# Altium project REG.PrjPcb (part 1 of 2)
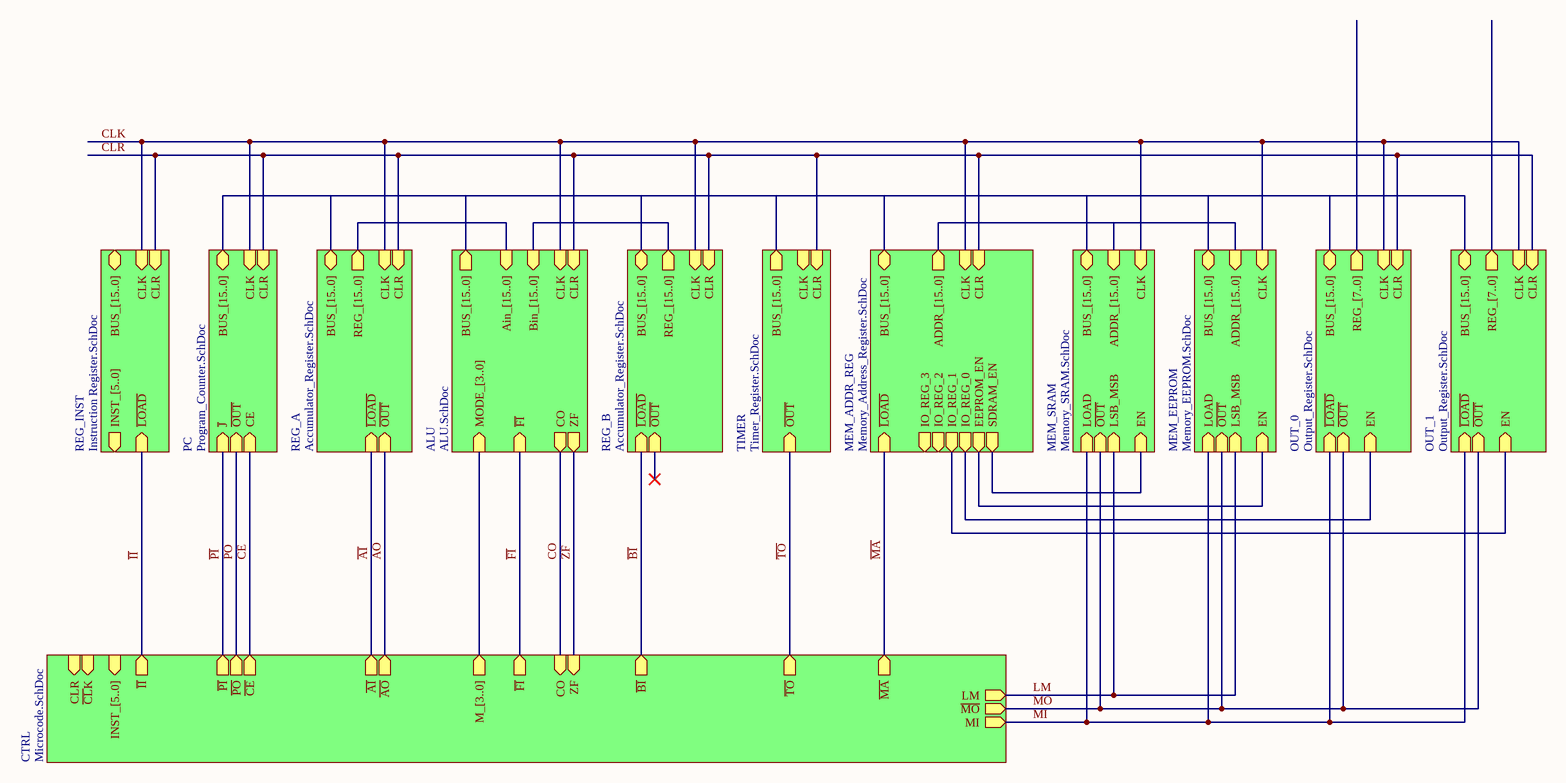
[diagram p0: TOP.SchDoc]
17 sheets, 108 parts. Net scope: hierarchical (ports join the sheet entries above them; power ports are global).
Board file: PCB1.PcbDoc
Sheets:
  TOP.SchDoc
    REG_A = Accumulator_Register.SchDoc
    REG_B = Accumulator_Register.SchDoc
    PC = Program_Counter.SchDoc
    MEM_ADDR_REG = Memory_Address_Register.SchDoc
    MEM_SRAM = Memory_SRAM.SchDoc
    MEM_EEPROM = Memory_EEPROM.SchDoc
    ALU = ALU.SchDoc
      ALU_ADDER = ALU_Adder.SchDoc
      ALU_AND = ALU_AND.SchDoc
      ALU_OR = ALU_OR.SchDoc
      ALU_XOR = ALU_XOR.SchDoc
      ALU_SHIFTER = ALU_Shifter.SchDoc
      ALU_ZF = ALU_ZF.SchDoc
    OUT_0 = Output_Register.SchDoc
    REG_INST = Instruction Register.SchDoc
    CTRL = Microcode.SchDoc
    TIMER = Timer_Register.SchDoc
    OUT_1 = Output_Register.SchDoc

## Sheet TOP.SchDoc
size B; Author: E. Sims; Organization: Let's Build Rockets Inc.; SheetNumber: 1; SheetTotal: 16

### Sub-sheets
ALU = ALU.SchDoc: MODE_[3..0] (in), BUS_[15..0] (out), Ain_[15..0] (in), Bin_[15..0] (in), CO (out), CLK (in), ~{FI} (in), ZF (out), CLR (in)
CTRL = Microcode.SchDoc: ~{AO} (out), ~{CE} (out), MI (out), ~{MA} (out), ~{FI} (out), ~{PI} (out), ~{AI} (out), ~{II} (out), CLR (in), ~{PO} (out), LM (out), ~{MO} (out), ~{TO} (out), INST_[5..0] (in), ~{CL}K (in), ~{BI} (out), M_[3..0] (out), ZF (in), CO (in)
MEM_ADDR_REG = Memory_Address_Register.SchDoc: CLK (in), CLR (in), ~{LOAD} (in), BUS_[15..0] (bidir), ADDR_[15..0] (out), EEPROM_EN (out), SDRAM_EN (out), IO_REG_2 (out), IO_REG_3 (out), IO_REG_1 (out), IO_REG_0 (out)
MEM_EEPROM = Memory_EEPROM.SchDoc: CLK (in), BUS_[15..0] (bidir), ADDR_[15..0] (in), LOAD (in), LSB_MSB (in), ~{OUT} (in), EN (in)
MEM_SRAM = Memory_SRAM.SchDoc: CLK (in), BUS_[15..0] (bidir), ADDR_[15..0] (in), LOAD (in), LSB_MSB (in), ~{OUT} (in), EN (in)
OUT_0 = Output_Register.SchDoc: ~{LOAD} (in), CLR (in), BUS_[15..0] (bidir), ~{OUT} (in), CLK (in), REG_[7..0] (out), EN (in)
OUT_1 = Output_Register.SchDoc: ~{LOAD} (in), CLR (in), BUS_[15..0] (bidir), ~{OUT} (in), CLK (in), REG_[7..0] (out), EN (in)
PC = Program_Counter.SchDoc: CLK (in), ~{OUT} (in), CLR (in), BUS_[15..0] (bidir), CE (in), ~{J} (in)
REG_A = Accumulator_Register.SchDoc: CLK (in), ~{OUT} (in), CLR (in), ~{LOAD} (in), BUS_[15..0] (bidir), REG_[15..0] (out)
REG_B = Accumulator_Register.SchDoc: CLK (in), ~{OUT} (in), CLR (in), ~{LOAD} (in), BUS_[15..0] (bidir), REG_[15..0] (out)
REG_INST = Instruction Register.SchDoc: CLK (in), CLR (in), BUS_[15..0] (bidir), ~{LOAD} (in), INST_[5..0] (out)
TIMER = Timer_Register.SchDoc: CLK (in), ~{OUT} (in), CLR (in), BUS_[15..0] (out)

### Nets
~{AI}: sheet REG_A/~{LOAD}, sheet CTRL/~{AI}
~{AO}: sheet REG_A/~{OUT}, sheet CTRL/~{AO}
~{BI}: sheet REG_B/~{LOAD}, sheet CTRL/~{BI}
~{CE}: sheet PC/CE, sheet CTRL/~{CE}
CLK: sheet REG_A/CLK, sheet REG_B/CLK, sheet PC/CLK, sheet MEM_ADDR_REG/CLK, sheet MEM_SRAM/CLK, sheet MEM_EEPROM/CLK, sheet ALU/CLK, sheet OUT_0/CLK, sheet REG_INST/CLK, sheet OUT_1/CLK
CLR: sheet REG_A/CLR, sheet REG_B/CLR, sheet PC/CLR, sheet MEM_ADDR_REG/CLR, sheet ALU/CLR, sheet OUT_0/CLR, sheet REG_INST/CLR, sheet TIMER/CLR, sheet OUT_1/CLR
CO: sheet ALU/CO, sheet CTRL/CO
EN: sheet MEM_ADDR_REG/EEPROM_EN, sheet MEM_EEPROM/EN
EN: sheet MEM_ADDR_REG/SDRAM_EN, sheet MEM_SRAM/EN  [a separate net that carries the same name]
EN: sheet MEM_ADDR_REG/IO_REG_0, sheet OUT_0/EN  [a separate net that carries the same name]
EN: sheet MEM_ADDR_REG/IO_REG_1, sheet OUT_1/EN  [a separate net that carries the same name]
~{FI}: sheet ALU/~{FI}, sheet CTRL/~{FI}
~{II}: sheet REG_INST/~{LOAD}, sheet CTRL/~{II}
LM: sheet MEM_SRAM/LSB_MSB, sheet MEM_EEPROM/LSB_MSB, sheet CTRL/LM
~{MA}: sheet MEM_ADDR_REG/~{LOAD}, sheet CTRL/~{MA}  [project net ~{LOAD}]
~{MO}: sheet MEM_SRAM/~{OUT}, sheet MEM_EEPROM/~{OUT}, sheet OUT_0/~{OUT}, sheet CTRL/~{MO}, sheet OUT_1/~{OUT}
MI: sheet MEM_SRAM/LOAD, sheet MEM_EEPROM/LOAD, sheet OUT_0/~{LOAD}, sheet CTRL/MI, sheet OUT_1/~{LOAD}  [project net ~{LOAD}]
~{PI}: sheet PC/~{J}, sheet CTRL/~{PI}  [project net ~{J}]
~{PO}: sheet PC/~{OUT}, sheet CTRL/~{PO}  [project net ~{OUT}]
~{TO}: sheet CTRL/~{TO}, sheet TIMER/~{OUT}  [project net ~{OUT}]
ZF: sheet ALU/ZF, sheet CTRL/ZF

### Buses and harness runs
bus sheet ALU/Ain_[15..0] = sheet REG_A/REG_[15..0]
bus sheet ALU/Bin_[15..0] = sheet REG_B/REG_[15..0]
bus sheet ALU/BUS_[15..0] = sheet MEM_ADDR_REG/BUS_[15..0] = sheet MEM_EEPROM/BUS_[15..0] = sheet MEM_SRAM/BUS_[15..0] = sheet OUT_0/BUS_[15..0] = sheet OUT_1/BUS_[15..0] = sheet PC/BUS_[15..0] = sheet REG_A/BUS_[15..0] = sheet REG_B/BUS_[15..0] = sheet TIMER/BUS_[15..0]
bus sheet ALU/MODE_[3..0] = sheet CTRL/M_[3..0]
bus sheet MEM_ADDR_REG/ADDR_[15..0] = sheet MEM_EEPROM/ADDR_[15..0] = sheet MEM_SRAM/ADDR_[15..0]

### Notes on the sheet
- Let's Build Rocket's Inc. Modular Paylaod System Based on TMP-010 Rev
  For more information visit https://github.com/LetsBuildRockets/Modular-Payload-System
  This work is licensed under CC BY-NC 4.0. To view a copy of this license, visit https://creativecommons.org/licenses/by-nc/4.0
- Title
- Size:
- Date:
- Assembly Variant:
- B
- Number:
- Time:
- Revision:
- Sheet
- of
- Author:
- File:

## Sheet Accumulator_Register.SchDoc
size B; Author: E. Sims; Organization: Let's Build Rockets Inc.; SheetNumber: 2; SheetTotal: 16
Used 2 times, as channels REG_A, REG_B. Parts and nets are listed once, with the designators drawn on the sheet.
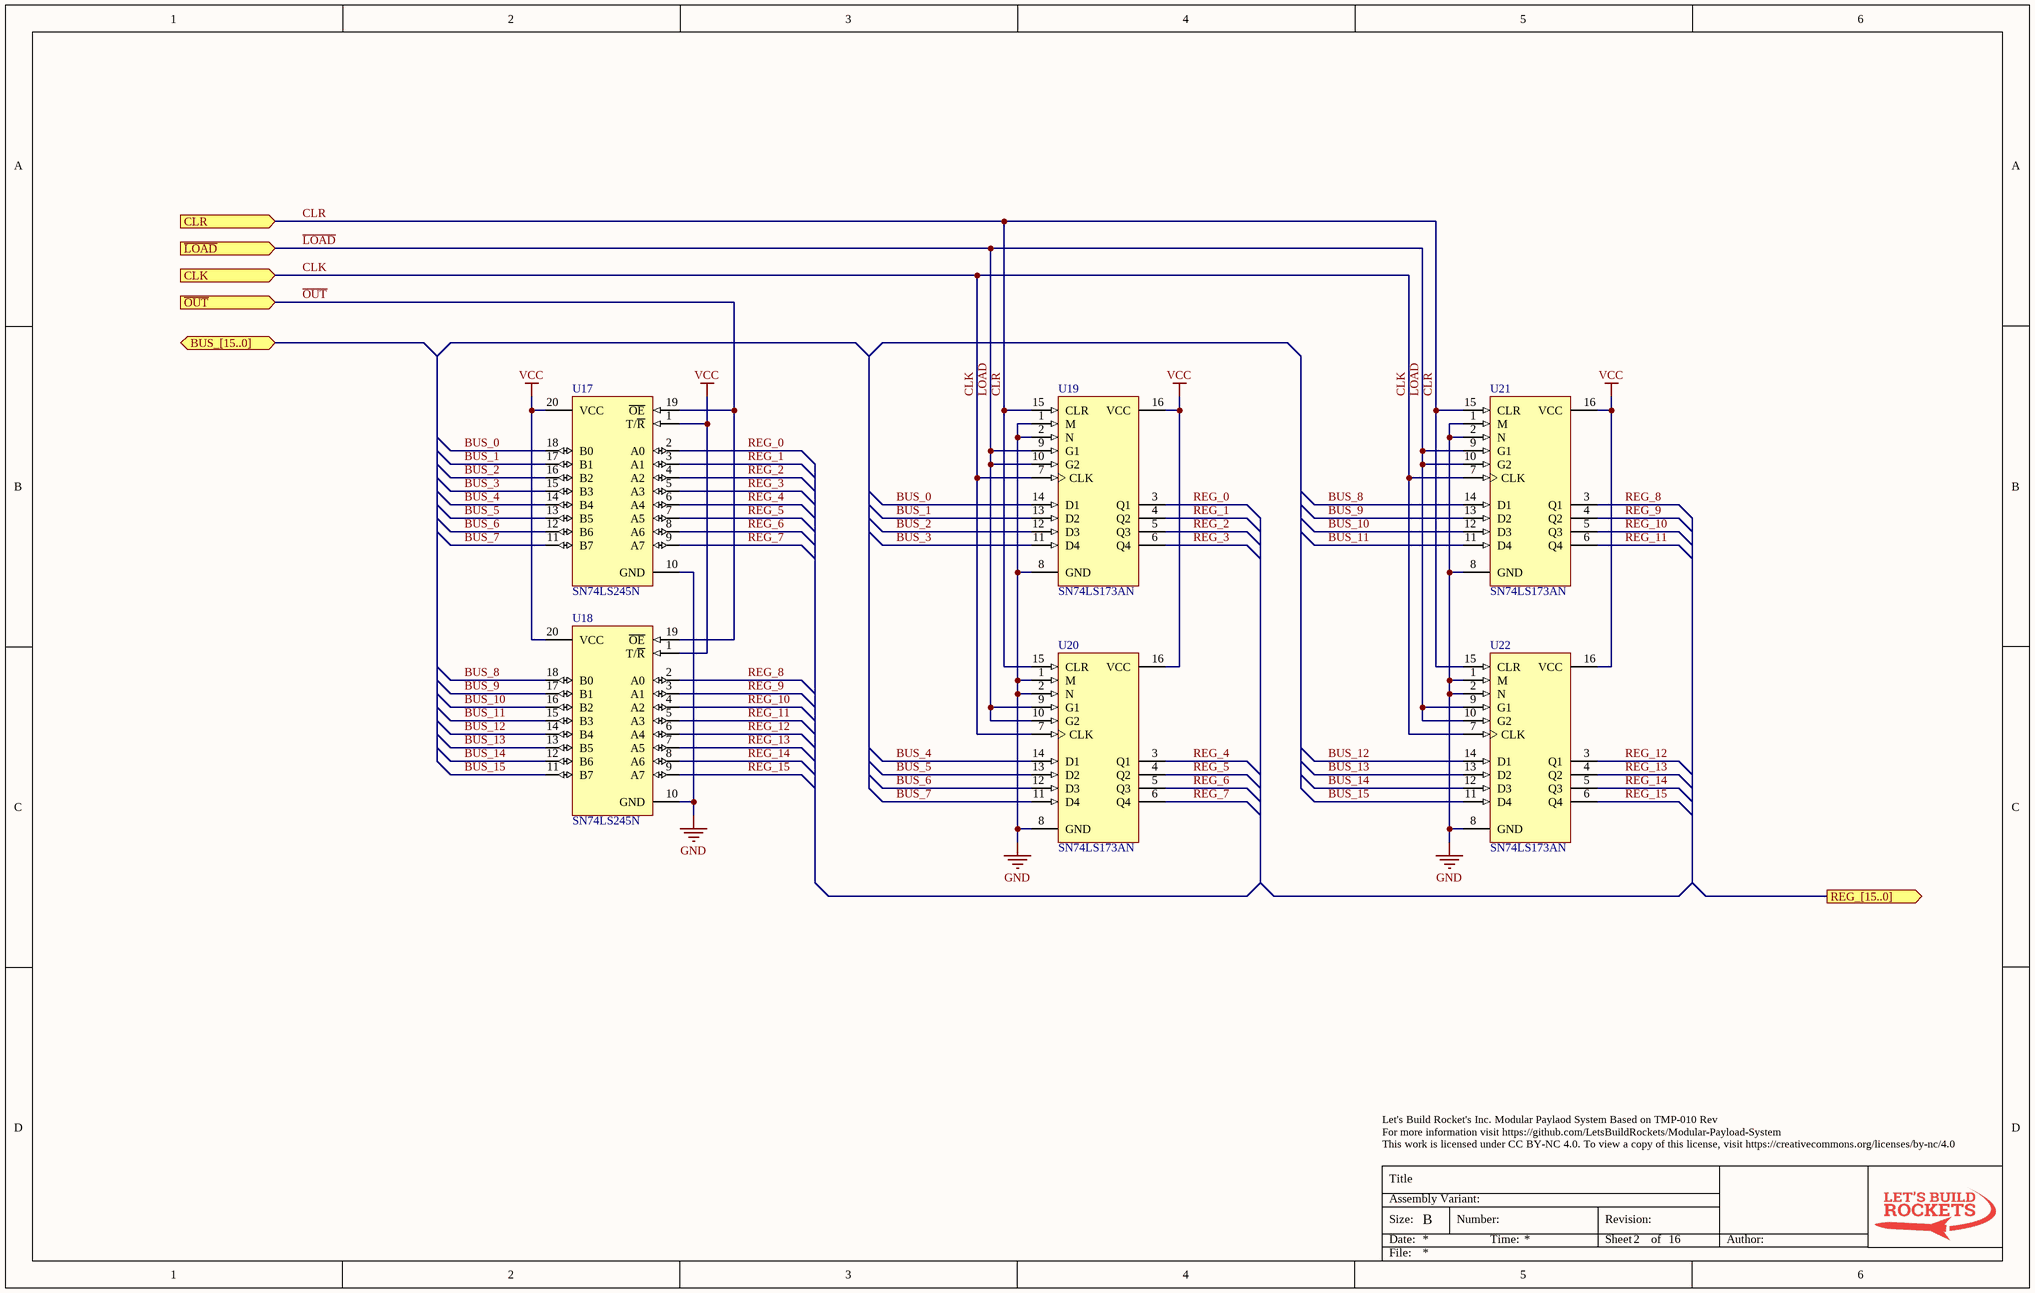
[diagram p1: Accumulator_Register.SchDoc]

### Parts
U17  SN74LS245N  [N020]
U18  SN74LS245N  [N020]
U19  SN74LS173AN  [N016D]
U20  SN74LS173AN  [N016D]
U21  SN74LS173AN  [N016D]
U22  SN74LS173AN  [N016D]

### Ports
BUS_[15..0] (bidir), CLK (in), CLR (in), REG_[15..0] (out), ~{LOAD} (in), ~{OUT} (in)

### Nets
GND: U17.10(GND) U18.10(GND) U19.1(M) U19.2(N) U19.8(GND) U20.1(M) U20.2(N) U20.8(GND) U21.1(M) U21.2(N) U21.8(GND) U22.1(M) U22.2(N) U22.8(GND)
VCC: U17.1(T/~{R}) U17.20(VCC) U18.1(T/~{R}) U18.20(VCC) U19.16(VCC) U20.16(VCC) U21.16(VCC) U22.16(VCC)
BUS_0: U17.18(B0) U19.14(D1)
BUS_1: U17.17(B1) U19.13(D2)
BUS_2: U17.16(B2) U19.12(D3)
BUS_3: U17.15(B3) U19.11(D4)
BUS_4: U17.14(B4) U20.14(D1)
BUS_5: U17.13(B5) U20.13(D2)
BUS_6: U17.12(B6) U20.12(D3)
BUS_7: U17.11(B7) U20.11(D4)
BUS_8: U18.18(B0) U21.14(D1)
BUS_9: U18.17(B1) U21.13(D2)
BUS_10: U18.16(B2) U21.12(D3)
BUS_11: U18.15(B3) U21.11(D4)
BUS_12: U18.14(B4) U22.14(D1)
BUS_13: U18.13(B5) U22.13(D2)
BUS_14: U18.12(B6) U22.12(D3)
BUS_15: U18.11(B7) U22.11(D4)
CLK: U19.7(CLK) U20.7(CLK) U21.7(CLK) U22.7(CLK) ; port CLK
CLR: U19.15(CLR) U20.15(CLR) U21.15(CLR) U22.15(CLR) ; port CLR
~{LOAD}: U19.9(G1) U19.10(G2) U20.9(G1) U20.10(G2) U21.9(G1) U21.10(G2) U22.9(G1) U22.10(G2) ; port ~{LOAD}
~{OUT}: U17.19(~{OE}) U18.19(~{OE}) ; port ~{OUT}
REG_0: U17.2(A0) U19.3(Q1)
REG_1: U17.3(A1) U19.4(Q2)
REG_2: U17.4(A2) U19.5(Q3)
REG_3: U17.5(A3) U19.6(Q4)
REG_4: U17.6(A4) U20.3(Q1)
REG_5: U17.7(A5) U20.4(Q2)
REG_6: U17.8(A6) U20.5(Q3)
REG_7: U17.9(A7) U20.6(Q4)
REG_8: U18.2(A0) U21.3(Q1)
REG_9: U18.3(A1) U21.4(Q2)
REG_10: U18.4(A2) U21.5(Q3)
REG_11: U18.5(A3) U21.6(Q4)
REG_12: U18.6(A4) U22.3(Q1)
REG_13: U18.7(A5) U22.4(Q2)
REG_14: U18.8(A6) U22.5(Q3)
REG_15: U18.9(A7) U22.6(Q4)

### Channels
REG_A: designators end in _REG_A; ports CLK=CLK CLR=CLR ~{LOAD}=~{AI} ~{OUT}=~{AO}
REG_B: designators end in _REG_B; ports CLK=CLK CLR=CLR ~{LOAD}=~{BI} ~{OUT}=~{OUT}_REG_B

### Notes on the sheet
- Let's Build Rocket's Inc. Modular Paylaod System Based on TMP-010 Rev
  For more information visit https://github.com/LetsBuildRockets/Modular-Payload-System
  This work is licensed under CC BY-NC 4.0. To view a copy of this license, visit https://creativecommons.org/licenses/by-nc/4.0
- Title
- Size:
- Date:
- Assembly Variant:
- B
- Number:
- Time:
- Revision:
- Sheet
- of
- Author:
- File:

### Library data of the parts
U17 U18 = SN74LS245N: Octal Bus Transceiver with 3-State Outputs; Published: 8-Jun-2000; LatestRevisionDate: 04-Mar-2005; LatestRevisionNote: Stylized 3D Model Added.; DatasheetVersion: Mar-1988; PackageVersion: Oct-1995; PackageReference: N020; Publisher: Altium Limited; PackageDescription: DIP; 20 Leads; Row Spacing 7.62 mm; Pitch 2.54 mm; ComponentLink1Description: Manufacturer Link; ComponentLink1URL: http://www.ti.com/; ComponentLink2Description: Datasheet; ComponentLink2URL: http://www-s.ti.com/sc/ds/sn74ls245.pdf
U19-U22 = SN74LS173AN: 4-Bit D-Type Register with 3-State Outputs; Published: 8-Jun-2000; LatestRevisionDate: 04-Mar-2005; LatestRevisionNote: Stylized 3D Model Added.; DatasheetVersion: Mar-1988; PackageVersion: Oct-1995; PackageReference: N016D; Publisher: Altium Limited; PackageDescription: DIP; 16 Leads; Row Spacing 7.62 mm; Pitch 2.54 mm; Code_JEDEC: MS-001-BB; ComponentLink1Description: Manufacturer Link; ComponentLink1URL: http://www.ti.com/; ComponentLink2Description: Datasheet; ComponentLink2URL: http://www-s.ti.com/sc/ds/sn74ls173a.pdf

## Sheet Program_Counter.SchDoc
size B; Author: E. Sims; Organization: Let's Build Rockets Inc.; SheetNumber: 3; SheetTotal: 16
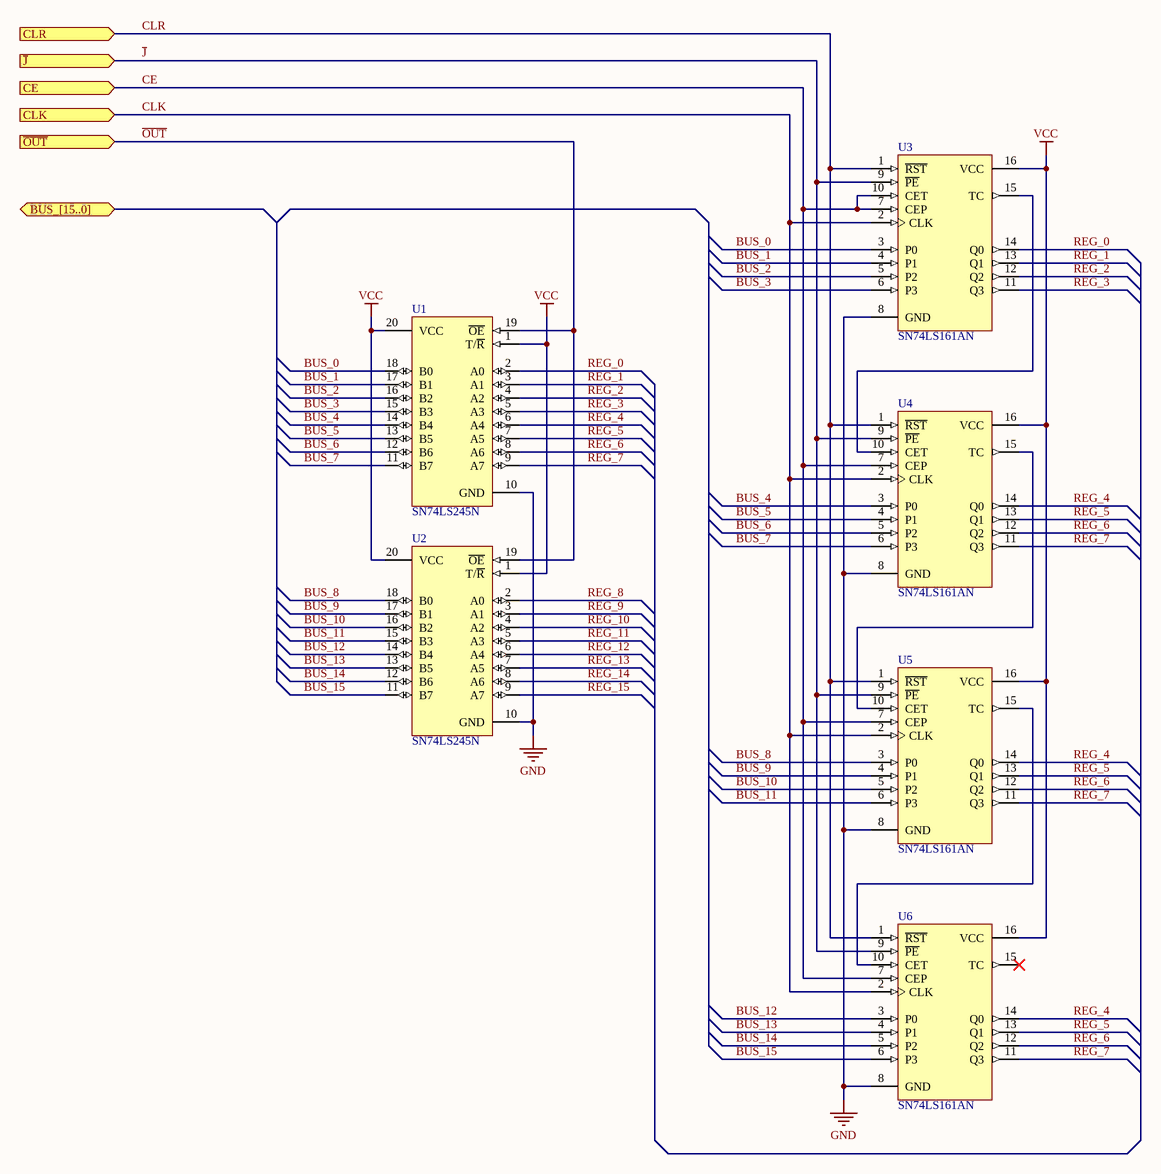
[diagram p2: Program_Counter.SchDoc]

### Parts
U1  SN74LS245N  [N020]
U2  SN74LS245N  [N020]
U3  SN74LS161AN  [N016]
U4  SN74LS161AN  [N016]
U5  SN74LS161AN  [N016]
U6  SN74LS161AN  [N016]

### Ports
BUS_[15..0] (bidir), CE (in), CLK (in), CLR (in), ~{J} (in), ~{OUT} (in)

### Nets
GND: U1.10(GND) U2.10(GND) U3.8(GND) U4.8(GND) U5.8(GND) U6.8(GND)
VCC: U1.1(T/~{R}) U1.20(VCC) U2.1(T/~{R}) U2.20(VCC) U3.16(VCC) U4.16(VCC) U5.16(VCC) U6.16(VCC)
BUS_0: U1.18(B0) U3.3(P0)
BUS_1: U1.17(B1) U3.4(P1)
BUS_2: U1.16(B2) U3.5(P2)
BUS_3: U1.15(B3) U3.6(P3)
BUS_4: U1.14(B4) U4.3(P0)
BUS_5: U1.13(B5) U4.4(P1)
BUS_6: U1.12(B6) U4.5(P2)
BUS_7: U1.11(B7) U4.6(P3)
BUS_8: U2.18(B0) U5.3(P0)
BUS_9: U2.17(B1) U5.4(P1)
BUS_10: U2.16(B2) U5.5(P2)
BUS_11: U2.15(B3) U5.6(P3)
BUS_12: U2.14(B4) U6.3(P0)
BUS_13: U2.13(B5) U6.4(P1)
BUS_14: U2.12(B6) U6.5(P2)
BUS_15: U2.11(B7) U6.6(P3)
CE: U3.7(CEP) U3.10(CET) U4.7(CEP) U5.7(CEP) U6.7(CEP) ; port CE  [project net ~{CE}]
CLK: U3.2(CLK) U4.2(CLK) U5.2(CLK) U6.2(CLK) ; port CLK
CLR: U3.1(~{RST}) U4.1(~{RST}) U5.1(~{RST}) U6.1(~{RST}) ; port CLR
~{J}: U3.9(~{PE}) U4.9(~{PE}) U5.9(~{PE}) U6.9(~{PE}) ; port ~{J}
~{OUT}: U1.19(~{OE}) U2.19(~{OE}) ; port ~{OUT}
REG_0: U1.2(A0) U3.14(Q0)
REG_1: U1.3(A1) U3.13(Q1)
REG_2: U1.4(A2) U3.12(Q2)
REG_3: U1.5(A3) U3.11(Q3)
REG_4: U1.6(A4) U4.14(Q0) U5.14(Q0) U6.14(Q0)
REG_5: U1.7(A5) U4.13(Q1) U5.13(Q1) U6.13(Q1)
REG_6: U1.8(A6) U4.12(Q2) U5.12(Q2) U6.12(Q2)
REG_7: U1.9(A7) U4.11(Q3) U5.11(Q3) U6.11(Q3)
REG_8: U2.2(A0)
REG_9: U2.3(A1)
REG_10: U2.4(A2)
REG_11: U2.5(A3)
REG_12: U2.6(A4)
REG_13: U2.7(A5)
REG_14: U2.8(A6)
REG_15: U2.9(A7)
NetU3_15: U3.15(TC) U4.10(CET)
NetU4_15: U4.15(TC) U5.10(CET)
NetU5_15: U5.15(TC) U6.10(CET)

Not connected (* = marked no-connect by the designer): U6 15(TC)*

### Notes on the sheet
- Let's Build Rocket's Inc. Modular Paylaod System Based on TMP-010 Rev
  For more information visit https://github.com/LetsBuildRockets/Modular-Payload-System
  This work is licensed under CC BY-NC 4.0. To view a copy of this license, visit https://creativecommons.org/licenses/by-nc/4.0
- Title
- Size:
- Date:
- Assembly Variant:
- B
- Number:
- Time:
- Revision:
- Sheet
- of
- Author:
- File:

### Library data of the parts
U1 U2 = SN74LS245N: as U17 on sheet Accumulator_Register; Published: 8-Jun-2000; LatestRevisionDate: 04-Mar-2005; LatestRevisionNote: Stylized 3D Model Added.; DatasheetVersion: Mar-1988; PackageVersion: Oct-1995; PackageReference: N020; Publisher: Altium Limited; PackageDescription: DIP; 20 Leads; Row Spacing 7.62 mm; Pitch 2.54 mm; ComponentLink1Description: Manufacturer Link; ComponentLink1URL: http://www.ti.com/; ComponentLink2Description: Datasheet; ComponentLink2URL: http://www-s.ti.com/sc/ds/sn74ls245.pdf
U3-U6 = SN74LS161AN: Synchronous 4-Bit Counter; Published: 8-Jun-2000; LatestRevisionDate: 04-Mar-2005; LatestRevisionNote: Stylized 3D Model Added.; DatasheetVersion: Mar-1988; PackageVersion: Oct-1995; PackageReference: N016; Publisher: Altium Limited; PackageDescription: DIP; 16 Leads; Row Spacing 7.62 mm; Pitch 2.54 mm; Code_JEDEC: MS-001-BB; ComponentLink1Description: Manufacturer Link; ComponentLink1URL: http://www.ti.com/; ComponentLink2Description: Datasheet; ComponentLink2URL: http://www-s.ti.com/sc/ds/sn74ls161a.pdf; ComponentLink3Description: URL Link1; ComponentLink3URL: http://focus.ti.com/docs/prod/folders/print/sn74ls161a.html

## Sheet Memory_Address_Register.SchDoc
size B; Author: E. Sims; Organization: Let's Build Rockets Inc.; SheetNumber: 4; SheetTotal: 16
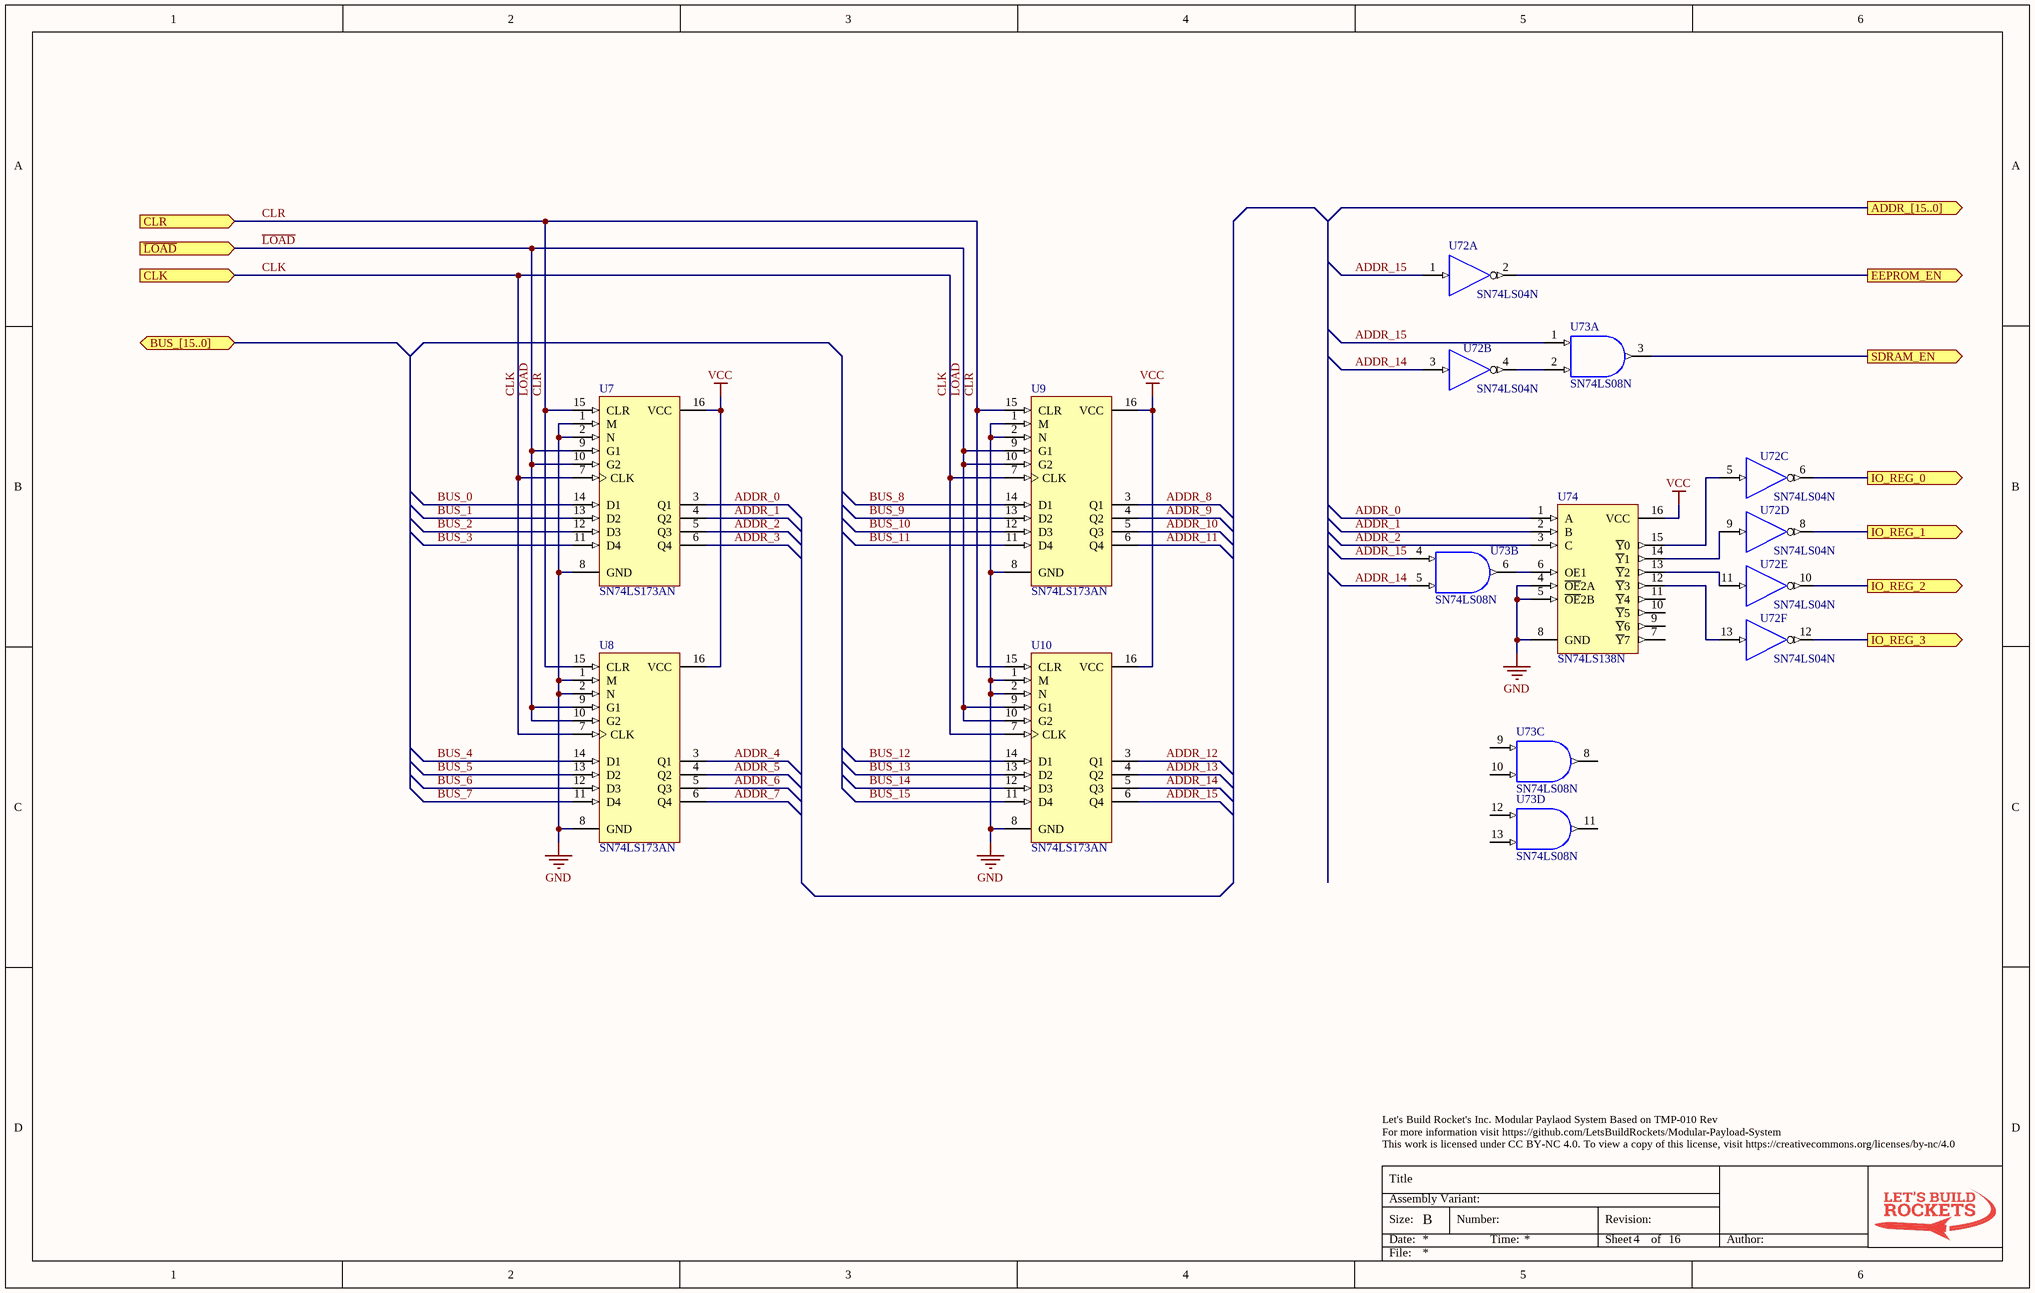
[diagram p3: Memory_Address_Register.SchDoc]

### Parts
U7  SN74LS173AN  [N016D]
U8  SN74LS173AN  [N016D]
U9  SN74LS173AN  [N016D]
U10  SN74LS173AN  [N016D]
U72  SN74LS04N  [N014]  (parts A,B,C,D,E,F of 6)
U73  SN74LS08N  [N014]  (parts A,B,C,D of 4)
U74  SN74LS138N  [N016]

### Ports
ADDR_[15..0] (out), BUS_[15..0] (bidir), CLK (in), CLR (in), EEPROM_EN (out), IO_REG_0 (out), IO_REG_1 (out), IO_REG_2 (out), IO_REG_3 (out), SDRAM_EN (out), ~{LOAD} (in)

### Nets
GND: U7.1(M) U7.2(N) U7.8(GND) U8.1(M) U8.2(N) U8.8(GND) U9.1(M) U9.2(N) U9.8(GND) U10.1(M) U10.2(N) U10.8(GND) U72.7(GND) U73.7(GND) U74.4(~{OE}2A) U74.5(~{OE}2B) U74.8(GND)
VCC: U7.16(VCC) U8.16(VCC) U9.16(VCC) U10.16(VCC) U72.14(VCC) U73.14(VCC) U74.16(VCC)
ADDR_0: U7.3(Q1) U74.1(A)
ADDR_1: U7.4(Q2) U74.2(B)
ADDR_2: U7.5(Q3) U74.3(C)
ADDR_3: U7.6(Q4)
ADDR_4: U8.3(Q1)
ADDR_5: U8.4(Q2)
ADDR_6: U8.5(Q3)
ADDR_7: U8.6(Q4)
ADDR_8: U9.3(Q1)
ADDR_9: U9.4(Q2)
ADDR_10: U9.5(Q3)
ADDR_11: U9.6(Q4)
ADDR_12: U10.3(Q1)
ADDR_13: U10.4(Q2)
ADDR_14: U10.5(Q3) U72.3(A) U73.5(B)
ADDR_15: U10.6(Q4) U72.1(A) U73.1(A) U73.4(A)
BUS_0: U7.14(D1)
BUS_1: U7.13(D2)
BUS_2: U7.12(D3)
BUS_3: U7.11(D4)
BUS_4: U8.14(D1)
BUS_5: U8.13(D2)
BUS_6: U8.12(D3)
BUS_7: U8.11(D4)
BUS_8: U9.14(D1)
BUS_9: U9.13(D2)
BUS_10: U9.12(D3)
BUS_11: U9.11(D4)
BUS_12: U10.14(D1)
BUS_13: U10.13(D2)
BUS_14: U10.12(D3)
BUS_15: U10.11(D4)
CLK: U7.7(CLK) U8.7(CLK) U9.7(CLK) U10.7(CLK) ; port CLK
CLR: U7.15(CLR) U8.15(CLR) U9.15(CLR) U10.15(CLR) ; port CLR
EN: U72.2(Y) ; port EEPROM_EN
EN: U73.3(Y) ; port SDRAM_EN  [a separate net that carries the same name]
EN: U72.6(Y) ; port IO_REG_0  [a separate net that carries the same name]
EN: U72.8(Y) ; port IO_REG_1  [a separate net that carries the same name]
~{LOAD}: U7.9(G1) U7.10(G2) U8.9(G1) U8.10(G2) U9.9(G1) U9.10(G2) U10.9(G1) U10.10(G2) ; port ~{LOAD}
NetU72_4: U72.4(Y) U73.2(B)
NetU72_5: U72.5(A) U74.15(~{Y}0)
NetU72_9: U72.9(A) U74.14(~{Y}1)
NetU72_10: U72.10(Y) ; port IO_REG_2
NetU72_11: U72.11(A) U74.13(~{Y}2)
NetU72_12: U72.12(Y) ; port IO_REG_3
NetU72_13: U72.13(A) U74.12(~{Y}3)
NetU73_6: U73.6(Y) U74.6(OE1)

Not connected (* = marked no-connect by the designer): U73 8(Y) 9(A) 10(B) 11(Y) 12(A) 13(B); U74 7(~{Y}7) 9(~{Y}6) 10(~{Y}5) 11(~{Y}4)

### Notes on the sheet
- Let's Build Rocket's Inc. Modular Paylaod System Based on TMP-010 Rev
  For more information visit https://github.com/LetsBuildRockets/Modular-Payload-System
  This work is licensed under CC BY-NC 4.0. To view a copy of this license, visit https://creativecommons.org/licenses/by-nc/4.0
- Title
- Size:
- Date:
- Assembly Variant:
- B
- Number:
- Time:
- Revision:
- Sheet
- of
- Author:
- File:

### Library data of the parts
U7-U10 = SN74LS173AN: as U19 on sheet Accumulator_Register; Published: 8-Jun-2000; LatestRevisionDate: 04-Mar-2005; LatestRevisionNote: Stylized 3D Model Added.; DatasheetVersion: Mar-1988; PackageVersion: Oct-1995; PackageReference: N016D; Publisher: Altium Limited; PackageDescription: DIP; 16 Leads; Row Spacing 7.62 mm; Pitch 2.54 mm; Code_JEDEC: MS-001-BB; ComponentLink1Description: Manufacturer Link; ComponentLink1URL: http://www.ti.com/; ComponentLink2Description: Datasheet; ComponentLink2URL: http://www-s.ti.com/sc/ds/sn74ls173a.pdf
U72 = SN74LS04N: Hex Inverter; Published: 8-Jun-2000; LatestRevisionDate: 04-Mar-2005; LatestRevisionNote: Stylized 3D Model Added.; DatasheetVersion: Mar-1988; PackageVersion: Oct-1995; PackageReference: N014; Publisher: Altium Limited; PackageDescription: DIP; 14 Leads; Row Spacing 7.62 mm; Pitch 2.54 mm; ComponentLink1Description: Manufacturer Link; ComponentLink1URL: http://www.ti.com/; ComponentLink2Description: Datasheet; ComponentLink2URL: http://www-s.ti.com/sc/ds/sn74ls04.pdf
U73 = SN74LS08N: Quadruple 2-Input Positive-AND Gate; Published: 8-Jun-2000; LatestRevisionDate: 04-Mar-2005; LatestRevisionNote: Stylized 3D Model Added.; DatasheetVersion: Mar-1988; PackageVersion: Oct-1995; PackageReference: N014; Publisher: Altium Limited; PackageDescription: DIP; 14 Leads; Row Spacing 7.62 mm; Pitch 2.54 mm; ComponentLink1Description: Manufacturer Link; ComponentLink1URL: http://www.ti.com/; ComponentLink2Description: Datasheet; ComponentLink2URL: http://www-s.ti.com/sc/ds/SN74LS08.pdf
U74 = SN74LS138N: 3-Line to 8-Line Decoder / Demultiplexer; Published: 8-Jun-2000; LatestRevisionDate: 04-Mar-2005; LatestRevisionNote: Stylized 3D Model Added.; DatasheetVersion: Mar-1988; PackageVersion: Oct-1995; PackageReference: N016; Publisher: Altium Limited; PackageDescription: DIP; 16 Leads; Row Spacing 7.62 mm; Pitch 2.54 mm; Code_JEDEC: MS-001-BB; ComponentLink1Description: Manufacturer Link; ComponentLink1URL: http://www.ti.com/; ComponentLink2Description: Datasheet; ComponentLink2URL: http://www-s.ti.com/sc/ds/sn74ls138.pdf

## Sheet Memory_SRAM.SchDoc
size B; Author: E. Sims; Organization: Let's Build Rockets Inc.; SheetNumber: 5; SheetTotal: 18
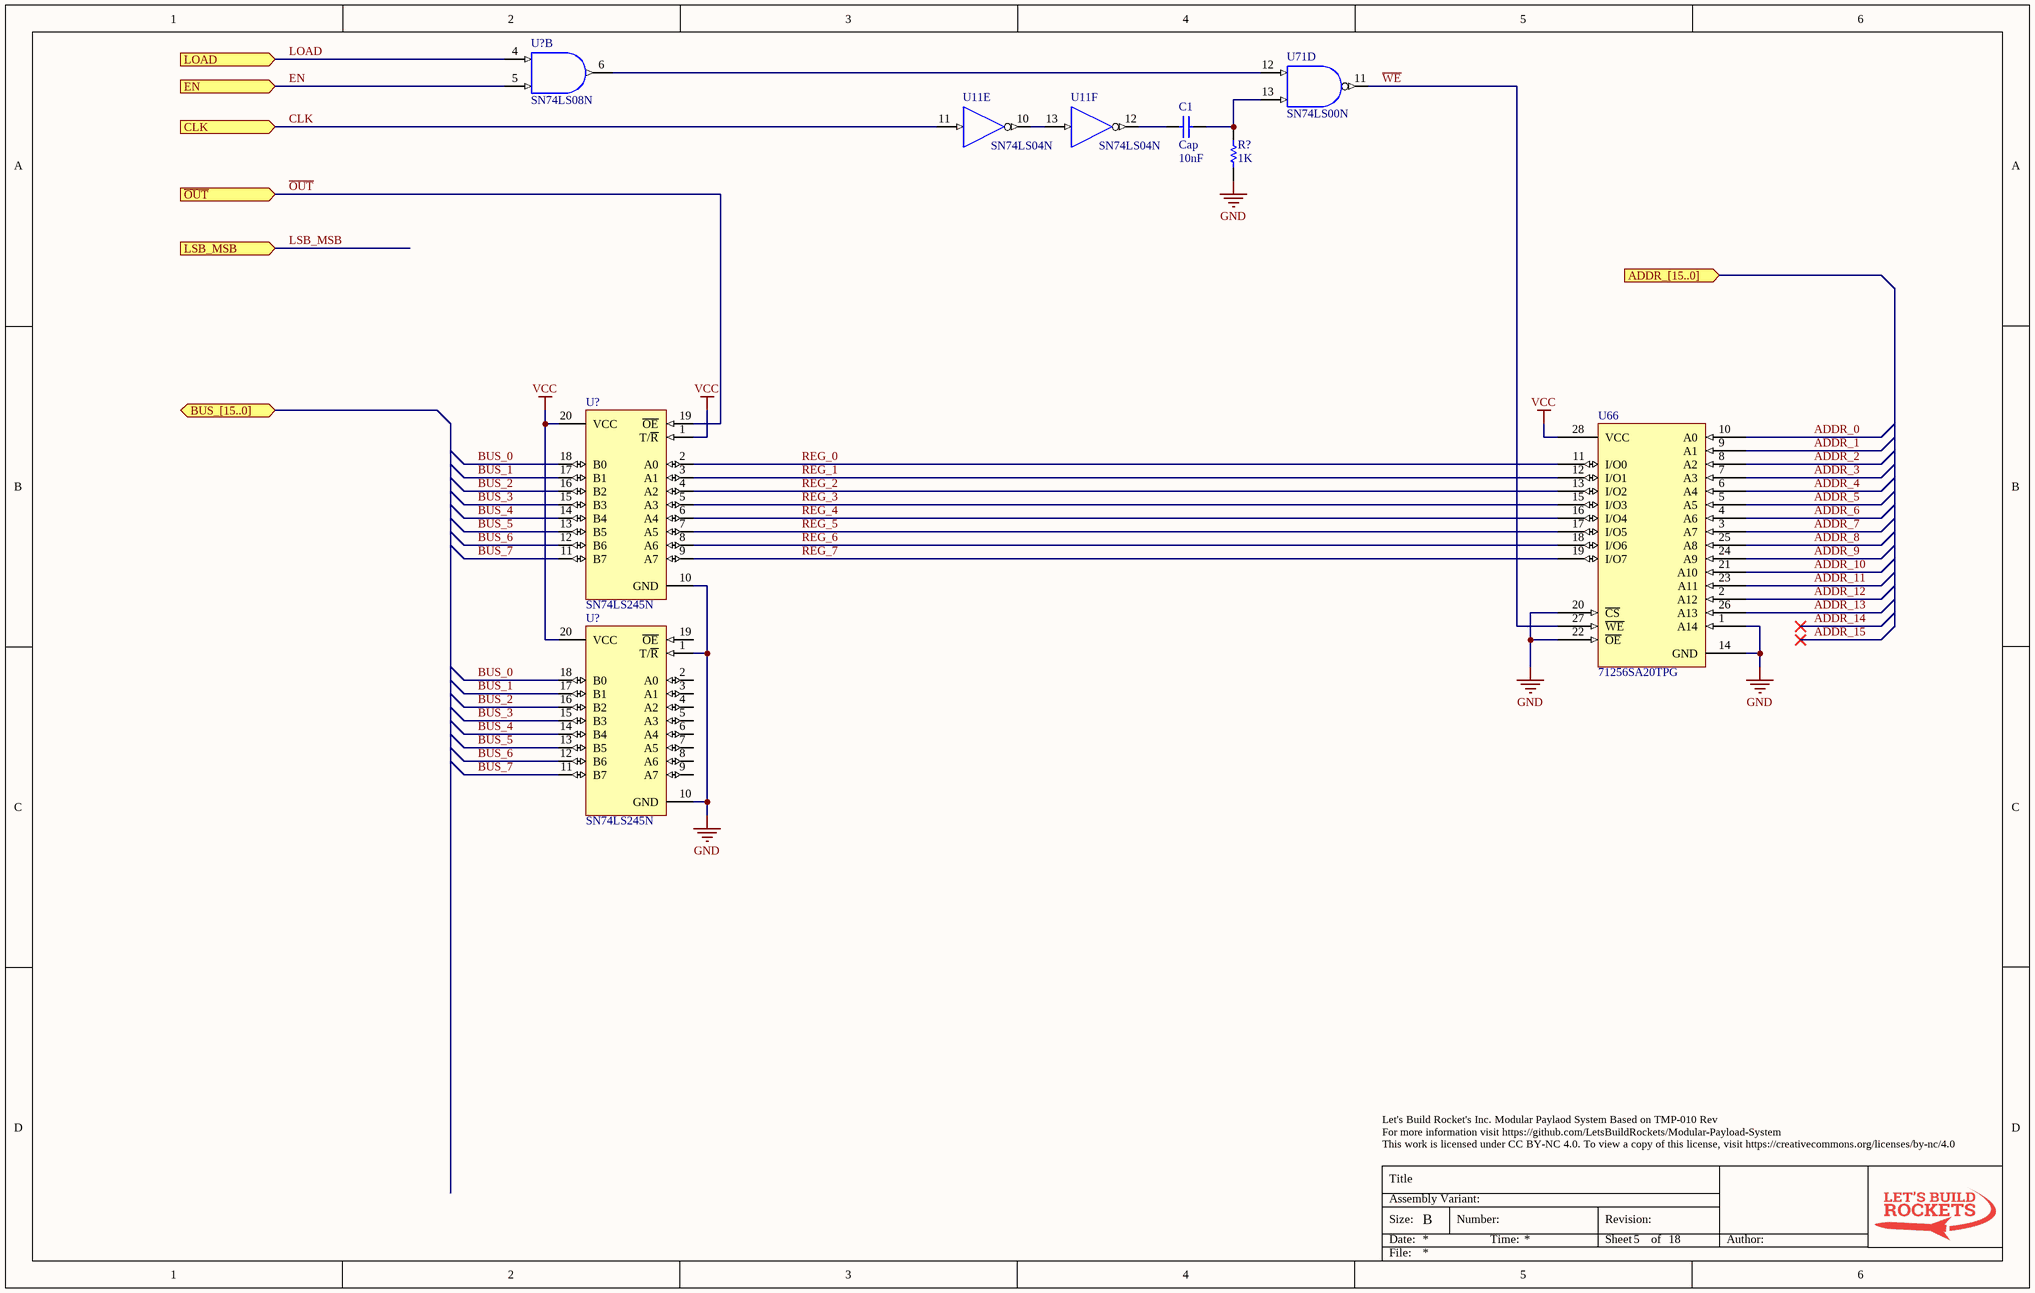
[diagram p4: Memory_SRAM.SchDoc]

### Parts
(Parts that share a designator on the sheet are numbered #1, #2 ... from top to bottom, then left to right.)
C1  Cap  value 10nF  [RAD-0.3]
R?  value 1K  [AXIAL-0.3]  (hidden comment: Res1)
U11  SN74LS04N  [N014]  (parts E,F of 6)
U66  71256SA20TPG  [JT028]
U71  SN74LS00N  [N014]  (part D of 4)
U?#1  SN74LS08N  [N014]  (part B of 4)
U?#2  SN74LS245N  [N020]
U?#3  SN74LS245N  [N020]

### Ports
ADDR_[15..0] (in), BUS_[15..0] (bidir), CLK (in), EN (in), LOAD (in), LSB_MSB (in), ~{OUT} (in)

### Nets
GND: R?.1 U11.7(GND) U66.1(A14) U66.14(GND) U66.20(~{CS}) U66.22(~{OE}) U71.7(GND) U?#1.7(GND) U?#2.10(GND) U?#3.1(T/~{R}) U?#3.10(GND)
VCC: U11.14(VCC) U66.28(VCC) U71.14(VCC) U?#1.14(VCC) U?#2.1(T/~{R}) U?#2.20(VCC) U?#3.20(VCC)
ADDR_0: U66.10(A0)
ADDR_1: U66.9(A1)
ADDR_2: U66.8(A2)
ADDR_3: U66.7(A3)
ADDR_4: U66.6(A4)
ADDR_5: U66.5(A5)
ADDR_6: U66.4(A6)
ADDR_7: U66.3(A7)
ADDR_8: U66.25(A8)
ADDR_9: U66.24(A9)
ADDR_10: U66.21(A10)
ADDR_11: U66.23(A11)
ADDR_12: U66.2(A12)
ADDR_13: U66.26(A13)
BUS_0: U?#2.18(B0) U?#3.18(B0)
BUS_1: U?#2.17(B1) U?#3.17(B1)
BUS_2: U?#2.16(B2) U?#3.16(B2)
BUS_3: U?#2.15(B3) U?#3.15(B3)
BUS_4: U?#2.14(B4) U?#3.14(B4)
BUS_5: U?#2.13(B5) U?#3.13(B5)
BUS_6: U?#2.12(B6) U?#3.12(B6)
BUS_7: U?#2.11(B7) U?#3.11(B7)
CLK: U11.11(A) ; port CLK
EN: U?#1.5(B) ; port EN
LOAD: U?#1.4(A) ; port LOAD  [project net ~{LOAD}]
~{OUT}: U?#2.19(~{OE}) ; port ~{OUT}  [project net ~{MO}]
REG_0: U66.11(I/O0) U?#2.2(A0)
REG_1: U66.12(I/O1) U?#2.3(A1)
REG_2: U66.13(I/O2) U?#2.4(A2)
REG_3: U66.15(I/O3) U?#2.5(A3)
REG_4: U66.16(I/O4) U?#2.6(A4)
REG_5: U66.17(I/O5) U?#2.7(A5)
REG_6: U66.18(I/O6) U?#2.8(A6)
REG_7: U66.19(I/O7) U?#2.9(A7)
~{WE}: U66.27(~{WE}) U71.11(Y)
NetC1_1: C1.1 R?.2 U71.13(B)
NetC1_2: C1.2 U11.12(Y)
NetU11_10: U11.10(Y) U11.13(A)
NetU71_12: U71.12(A) U?#1.6(Y)

Not connected (* = marked no-connect by the designer): U?#3 2(A0) 3(A1) 4(A2) 5(A3) 6(A4) 7(A5) 8(A6) 9(A7) 19(~{OE})

### Notes on the sheet
- Let's Build Rocket's Inc. Modular Paylaod System Based on TMP-010 Rev
  For more information visit https://github.com/LetsBuildRockets/Modular-Payload-System
  This work is licensed under CC BY-NC 4.0. To view a copy of this license, visit https://creativecommons.org/licenses/by-nc/4.0
- Title
- Size:
- Date:
- Assembly Variant:
- B
- Number:
- Time:
- Revision:
- Sheet
- of
- Author:
- File:

### Library data of the parts
C1 = Cap: Capacitor; Published: 8-Jun-2000; LatestRevisionDate: 17-Jul-2002; LatestRevisionNote: Re-released for DXP Platform.; PackageReference: RAD-0.3; Publisher: Altium Limited; PackageDescription: Radial Cap, Thru-Hole; 2 Leads; 0.3 in Pin Spacing
R? = Res1: Resistor; Published: 8-Jun-2000; LatestRevisionDate: 17-Jul-2002; LatestRevisionNote: Re-released for DXP Platform.; PackageReference: AXIAL-0.3; Publisher: Altium Limited; PackageDescription: Axial Device, Thru-Hole; 2 Leads; 0.3 in Pin Spacing
U11 = SN74LS04N: Hex Inverter; Published: 8-Jun-2000; LatestRevisionDate: 04-Mar-2005; LatestRevisionNote: Stylized 3D Model Added.; DatasheetVersion: Mar-1988; PackageVersion: Oct-1995; PackageReference: N014; Publisher: Altium Limited; PackageDescription: DIP; 14 Leads; Row Spacing 7.62 mm; Pitch 2.54 mm; ComponentLink1Description: Manufacturer Link; ComponentLink1URL: http://www.ti.com/; ComponentLink2Description: Datasheet; ComponentLink2URL: http://www-s.ti.com/sc/ds/sn74ls04.pdf
U71 = SN74LS00N: Quadruple 2-Input Positive-NAND Gate; Published: 8-Jun-2000; LatestRevisionDate: 04-Mar-2005; LatestRevisionNote: Stylized 3D Model Added.; DatasheetVersion: Mar-1988; PackageVersion: Oct-1995; PackageReference: N014; Publisher: Altium Limited; PackageDescription: DIP; 14 Leads; Row Spacing 7.62 mm; Pitch 2.54 mm; ComponentLink1Description: Manufacturer Link; ComponentLink1URL: http://www.ti.com/; ComponentLink2Description: Datasheet; ComponentLink2URL: http://www-s.ti.com/sc/ds/sn74ls00.pdf
U?#1 = SN74LS08N: Quadruple 2-Input Positive-AND Gate; Published: 8-Jun-2000; LatestRevisionDate: 04-Mar-2005; LatestRevisionNote: Stylized 3D Model Added.; DatasheetVersion: Mar-1988; PackageVersion: Oct-1995; PackageReference: N014; Publisher: Altium Limited; PackageDescription: DIP; 14 Leads; Row Spacing 7.62 mm; Pitch 2.54 mm; ComponentLink1Description: Manufacturer Link; ComponentLink1URL: http://www.ti.com/; ComponentLink2Description: Datasheet; ComponentLink2URL: http://www-s.ti.com/sc/ds/SN74LS08.pdf
U?#2 U?#3 = SN74LS245N: as U17 on sheet Accumulator_Register; Published: 8-Jun-2000; LatestRevisionDate: 04-Mar-2005; LatestRevisionNote: Stylized 3D Model Added.; DatasheetVersion: Mar-1988; PackageVersion: Oct-1995; PackageReference: N020; Publisher: Altium Limited; PackageDescription: DIP; 20 Leads; Row Spacing 7.62 mm; Pitch 2.54 mm; ComponentLink1Description: Manufacturer Link; ComponentLink1URL: http://www.ti.com/; ComponentLink2Description: Datasheet; ComponentLink2URL: http://www-s.ti.com/sc/ds/sn74ls245.pdf

## Sheet Memory_EEPROM.SchDoc
size B; Author: E. Sims; Organization: Let's Build Rockets Inc.; SheetNumber: 6; SheetTotal: 16
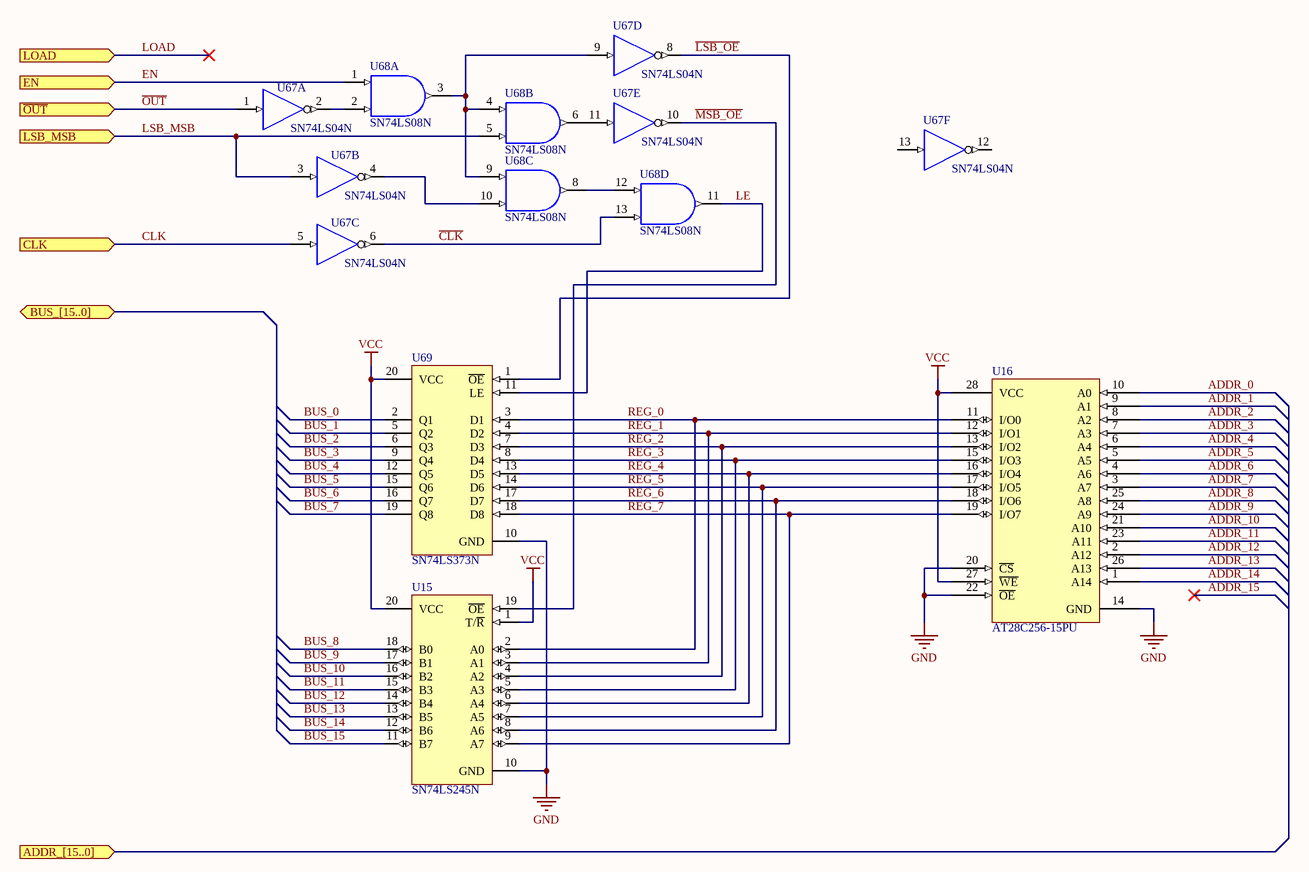
[diagram p5: Memory_EEPROM.SchDoc]

### Parts
U15  SN74LS245N  [N020]
U16  AT28C256-15PU  [J028]
U67  SN74LS04N  [N014]  (parts A,B,C,D,E,F of 6)
U68  SN74LS08N  [N014]  (parts A,B,C,D of 4)
U69  SN74LS373N  [N020]

### Ports
ADDR_[15..0] (in), BUS_[15..0] (bidir), CLK (in), EN (in), LOAD (in), LSB_MSB (in), ~{OUT} (in)

### Nets
GND: U15.10(GND) U16.14(GND) U16.20(~{CS}) U16.22(~{OE}) U67.7(GND) U68.7(GND) U69.10(GND)
VCC: U15.1(T/~{R}) U15.20(VCC) U16.27(~{WE}) U16.28(VCC) U67.14(VCC) U68.14(VCC) U69.20(VCC)
ADDR_0: U16.10(A0)
ADDR_1: U16.9(A1)
ADDR_2: U16.8(A2)
ADDR_3: U16.7(A3)
ADDR_4: U16.6(A4)
ADDR_5: U16.5(A5)
ADDR_6: U16.4(A6)
ADDR_7: U16.3(A7)
ADDR_8: U16.25(A8)
ADDR_9: U16.24(A9)
ADDR_10: U16.21(A10)
ADDR_11: U16.23(A11)
ADDR_12: U16.2(A12)
ADDR_13: U16.26(A13)
ADDR_14: U16.1(A14)
BUS_0: U69.2(Q1)
BUS_1: U69.5(Q2)
BUS_2: U69.6(Q3)
BUS_3: U69.9(Q4)
BUS_4: U69.12(Q5)
BUS_5: U69.15(Q6)
BUS_6: U69.16(Q7)
BUS_7: U69.19(Q8)
BUS_8: U15.18(B0)
BUS_9: U15.17(B1)
BUS_10: U15.16(B2)
BUS_11: U15.15(B3)
BUS_12: U15.14(B4)
BUS_13: U15.13(B5)
BUS_14: U15.12(B6)
BUS_15: U15.11(B7)
~{CLK}: U67.6(Y) U68.13(B)
CLK: U67.5(A) ; port CLK
EN: U68.1(A) ; port EN
~{LSB_OE}: U67.8(Y) U69.1(~{OE})
LE: U68.11(Y) U69.11(LE)
LSB_MSB: U67.3(A) U68.5(B) ; port LSB_MSB  [project net LM]
~{MSB_OE}: U15.19(~{OE}) U67.10(Y)
~{OUT}: U67.1(A) ; port ~{OUT}  [project net ~{MO}]
REG_0: U15.2(A0) U16.11(I/O0) U69.3(D1)
REG_1: U15.3(A1) U16.12(I/O1) U69.4(D2)
REG_2: U15.4(A2) U16.13(I/O2) U69.7(D3)
REG_3: U15.5(A3) U16.15(I/O3) U69.8(D4)
REG_4: U15.6(A4) U16.16(I/O4) U69.13(D5)
REG_5: U15.7(A5) U16.17(I/O5) U69.14(D6)
REG_6: U15.8(A6) U16.18(I/O6) U69.17(D7)
REG_7: U15.9(A7) U16.19(I/O7) U69.18(D8)
NetU67_2: U67.2(Y) U68.2(B)
NetU67_4: U67.4(Y) U68.10(B)
NetU67_9: U67.9(A) U68.3(Y) U68.4(A) U68.9(A)
NetU67_11: U67.11(A) U68.6(Y)
NetU68_8: U68.8(Y) U68.12(A)

Not connected (* = marked no-connect by the designer): U67 12(Y) 13(A)

### Notes on the sheet
- Let's Build Rocket's Inc. Modular Paylaod System Based on TMP-010 Rev
  For more information visit https://github.com/LetsBuildRockets/Modular-Payload-System
  This work is licensed under CC BY-NC 4.0. To view a copy of this license, visit https://creativecommons.org/licenses/by-nc/4.0
- Title
- Size:
- Date:
- Assembly Variant:
- B
- Number:
- Time:
- Revision:
- Sheet
- of
- Author:
- File:

### Library data of the parts
U15 = SN74LS245N: as U17 on sheet Accumulator_Register; Published: 8-Jun-2000; LatestRevisionDate: 04-Mar-2005; LatestRevisionNote: Stylized 3D Model Added.; DatasheetVersion: Mar-1988; PackageVersion: Oct-1995; PackageReference: N020; Publisher: Altium Limited; PackageDescription: DIP; 20 Leads; Row Spacing 7.62 mm; Pitch 2.54 mm; ComponentLink1Description: Manufacturer Link; ComponentLink1URL: http://www.ti.com/; ComponentLink2Description: Datasheet; ComponentLink2URL: http://www-s.ti.com/sc/ds/sn74ls245.pdf
U67 = SN74LS04N: Hex Inverter; Published: 8-Jun-2000; LatestRevisionDate: 04-Mar-2005; LatestRevisionNote: Stylized 3D Model Added.; DatasheetVersion: Mar-1988; PackageVersion: Oct-1995; PackageReference: N014; Publisher: Altium Limited; PackageDescription: DIP; 14 Leads; Row Spacing 7.62 mm; Pitch 2.54 mm; ComponentLink1Description: Manufacturer Link; ComponentLink1URL: http://www.ti.com/; ComponentLink2Description: Datasheet; ComponentLink2URL: http://www-s.ti.com/sc/ds/sn74ls04.pdf
U68 = SN74LS08N: Quadruple 2-Input Positive-AND Gate; Published: 8-Jun-2000; LatestRevisionDate: 04-Mar-2005; LatestRevisionNote: Stylized 3D Model Added.; DatasheetVersion: Mar-1988; PackageVersion: Oct-1995; PackageReference: N014; Publisher: Altium Limited; PackageDescription: DIP; 14 Leads; Row Spacing 7.62 mm; Pitch 2.54 mm; ComponentLink1Description: Manufacturer Link; ComponentLink1URL: http://www.ti.com/; ComponentLink2Description: Datasheet; ComponentLink2URL: http://www-s.ti.com/sc/ds/SN74LS08.pdf
U69 = SN74LS373N: Octal D-Type Transparent Latche and Edge-Triggered Flip-Flops; Published: 8-Jun-2000; LatestRevisionDate: 04-Mar-2005; LatestRevisionNote: Stylized 3D Model Added.; DatasheetVersion: Mar-1988; PackageVersion: Oct-1995; PackageReference: N020; Publisher: Altium Limited; PackageDescription: DIP; 20 Leads; Row Spacing 7.62 mm; Pitch 2.54 mm; ComponentLink1Description: Manufacturer Link; ComponentLink1URL: http://www.ti.com/; ComponentLink2Description: Datasheet; ComponentLink2URL: http://www-s.ti.com/sc/ds/sn74s373.pdf

## Sheet ALU.SchDoc
size B; Author: E. Sims; Organization: Let's Build Rockets Inc.; SheetNumber: 4; SheetTotal: 11
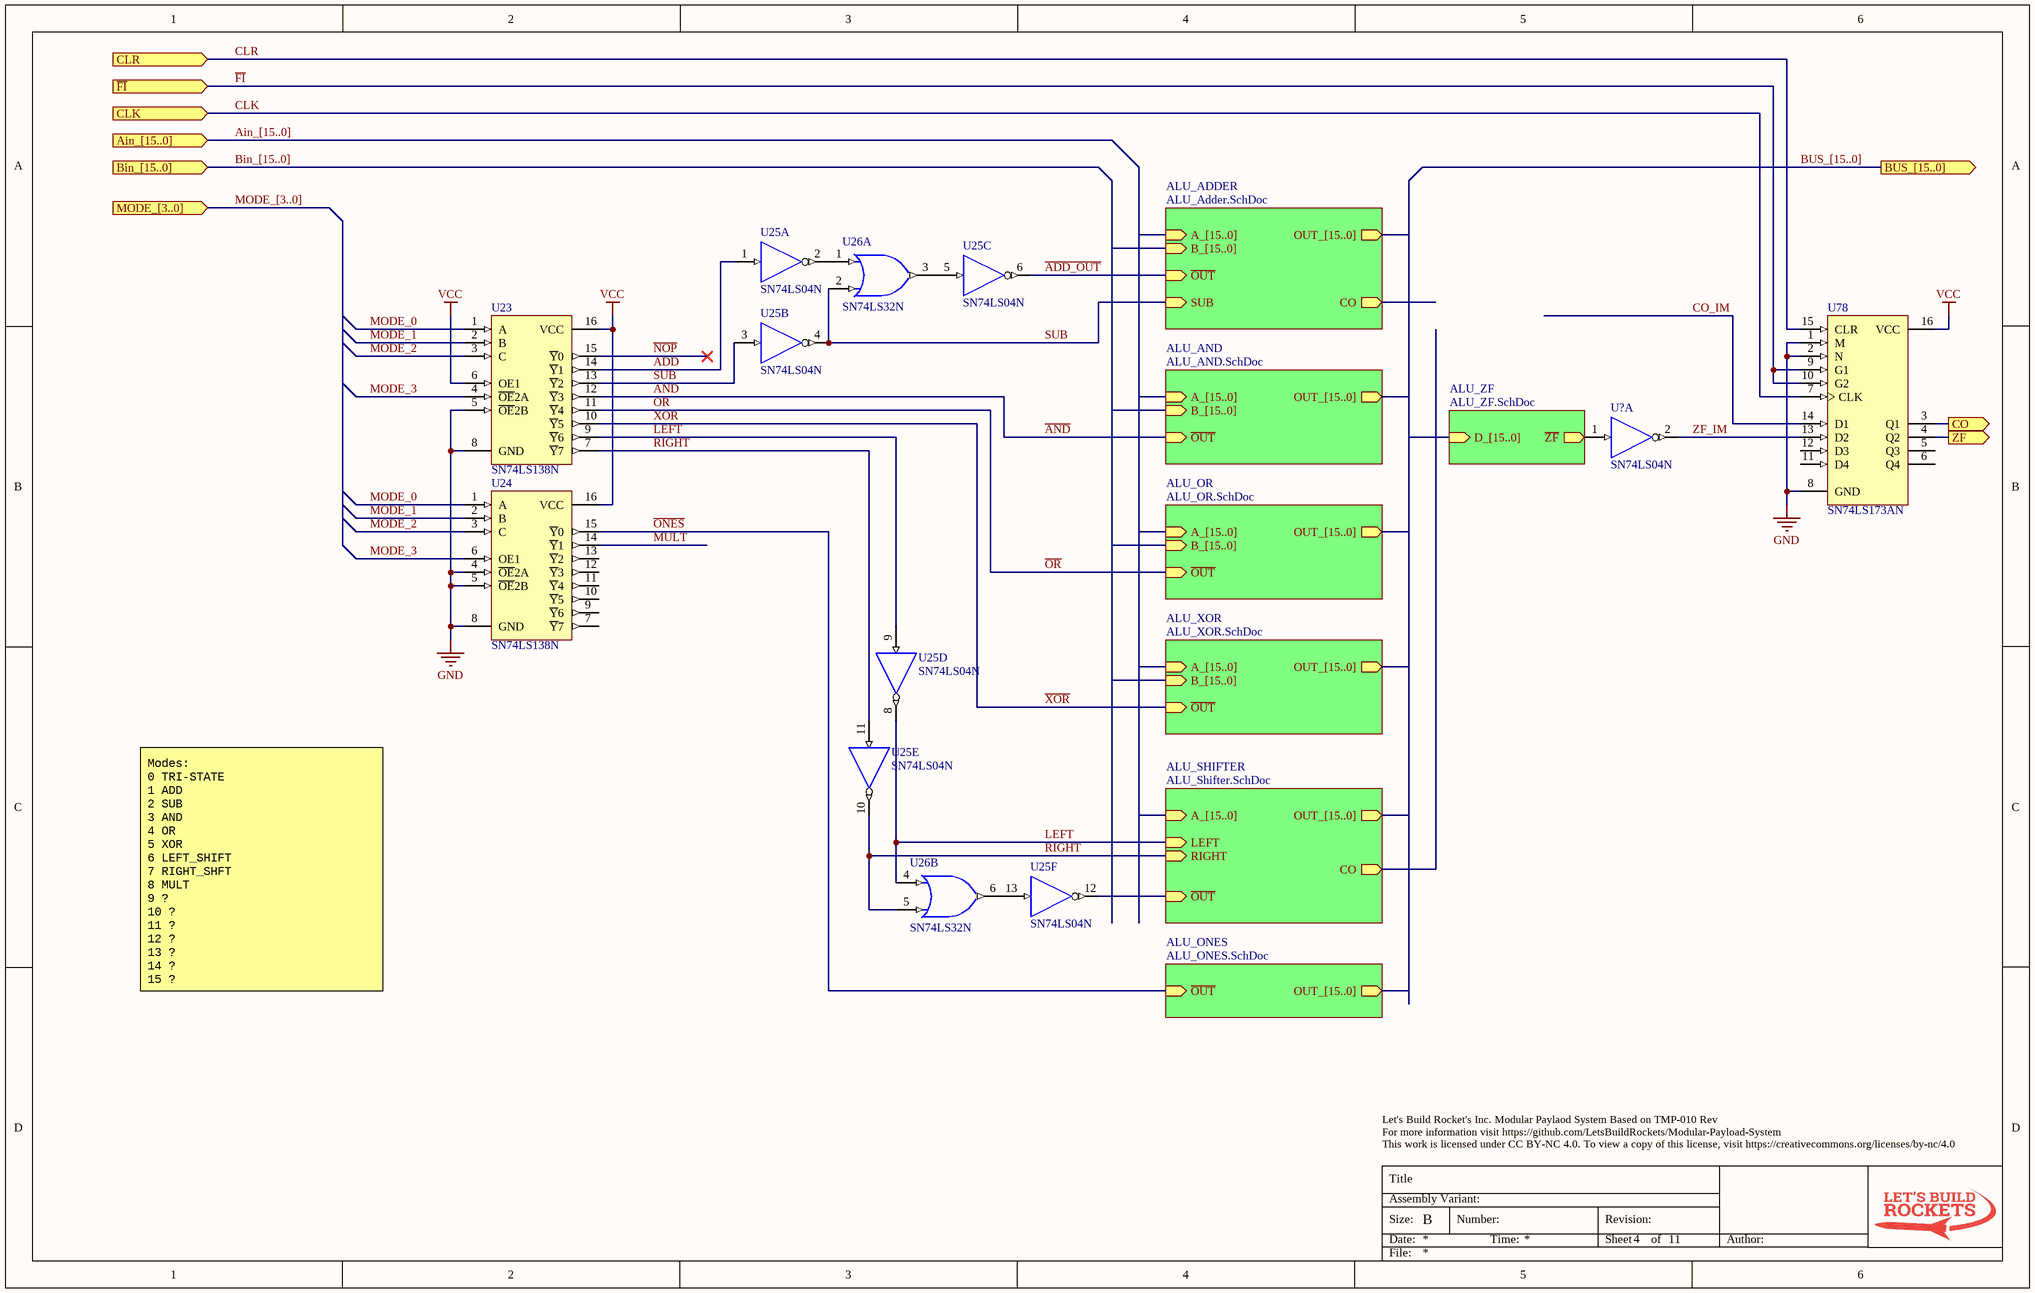
[diagram p6: ALU.SchDoc]

### Parts
(Parts that share a designator on the sheet are numbered #1, #2 ... from top to bottom, then left to right.)
U23  SN74LS138N  [N016]
U24  SN74LS138N  [N016]
U25#1  SN74LS04N  [N014]  (parts A,B,C,D,E,F of 6)
U25#2  SN74LS04N  [N014]  (part A of 6)
U26  SN74LS32N  [N014]  (parts A,B of 4)
U78  SN74LS173AN  [N016D]

### Sub-sheets
ALU_ADDER = ALU_Adder.SchDoc: B_[15..0] (in), ~{OUT} (in), OUT_[15..0] (out), SUB (in), A_[15..0] (in), CO (out)
ALU_AND = ALU_AND.SchDoc: B_[15..0] (in), ~{OUT} (in), OUT_[15..0] (out), A_[15..0] (in)
ALU_ONES = ALU_ONES.SchDoc (file not in this document): ~{OUT} (in), OUT_[15..0] (out)
ALU_OR = ALU_OR.SchDoc: B_[15..0] (in), ~{OUT} (in), OUT_[15..0] (out), A_[15..0] (in)
ALU_SHIFTER = ALU_Shifter.SchDoc: ~{OUT} (in), OUT_[15..0] (out), A_[15..0] (in), CO (out), LEFT (in), RIGHT (in)
ALU_XOR = ALU_XOR.SchDoc: B_[15..0] (in), ~{OUT} (in), OUT_[15..0] (out), A_[15..0] (in)
ALU_ZF = ALU_ZF.SchDoc: D_[15..0] (in), ~{ZF} (out)

### Ports
Ain_[15..0] (in), Bin_[15..0] (in), BUS_[15..0] (out), CLK (in), CLR (in), CO (out), MODE_[3..0] (in), ZF (out), ~{FI} (in)

### Nets
GND: U23.5(~{OE}2B) U23.8(GND) U24.4(~{OE}2A) U24.5(~{OE}2B) U24.8(GND) U25#1.7(GND) U25#2.7(GND) U26.7(GND) U78.1(M) U78.2(N) U78.8(GND)
VCC: U23.6(OE1) U23.16(VCC) U24.16(VCC) U25#1.14(VCC) U25#2.14(VCC) U26.14(VCC) U78.16(VCC)
~{ADD}: U23.14(~{Y}1) U25#1.1(A)
~{ADD_OUT}: U25#1.6(Y) ; sheet ALU_ADDER/~{OUT}
~{AND}: U23.12(~{Y}3) ; sheet ALU_AND/~{OUT}
CLK: U78.7(CLK) ; port CLK
CLR: U78.15(CLR) ; port CLR
CO: U78.3(Q1) ; port CO
CO_IM: U78.14(D1)
~{FI}: U78.9(G1) U78.10(G2) ; port ~{FI}
~{LEFT}: U23.9(~{Y}6) U25#1.9(A)
LEFT: U25#1.8(Y) U26.4(A) ; sheet ALU_SHIFTER/LEFT
~{MULT}: U24.14(~{Y}1)
MODE_0: U23.1(A) U24.1(A)
MODE_1: U23.2(B) U24.2(B)
MODE_2: U23.3(C) U24.3(C)
MODE_3: U23.4(~{OE}2A) U24.6(OE1)
~{NOP}: U23.15(~{Y}0)
~{ONES}: U24.15(~{Y}0) ; sheet ALU_ONES/~{OUT}
~{OR}: U23.11(~{Y}4) ; sheet ALU_OR/~{OUT}
~{OUT}: U25#1.12(Y) ; sheet ALU_SHIFTER/~{OUT}
~{RIGH}T: U23.7(~{Y}7) U25#1.11(A)
RIGHT: U25#1.10(Y) U26.5(B) ; sheet ALU_SHIFTER/RIGHT
~{SUB}: U23.13(~{Y}2) U25#1.3(A)
SUB: U25#1.4(Y) U26.2(B) ; sheet ALU_ADDER/SUB
~{XOR}: U23.10(~{Y}5) ; sheet ALU_XOR/~{OUT}  [project net ~{OUT}]
ZF: U78.4(Q2) ; port ZF
ZF_IM: U25#2.2(Y) U78.13(D2)
NetU25#1_2: U25#1.2(Y) U26.1(A)
NetU25#1_5: U25#1.5(A) U26.3(Y)
NetU25#1_13: U25#1.13(A) U26.6(Y)
NetU25#2_1: U25#2.1(A) ; sheet ALU_ZF/~{ZF}

Not connected (* = marked no-connect by the designer): U24 7(~{Y}7) 9(~{Y}6) 10(~{Y}5) 11(~{Y}4) 12(~{Y}3) 13(~{Y}2); U78 5(Q3) 6(Q4) 11(D4) 12(D3)

### Buses and harness runs
bus Ain_[15..0] = port Ain_[15..0] = sheet ALU_ADDER/A_[15..0] = sheet ALU_AND/A_[15..0] = sheet ALU_OR/A_[15..0] = sheet ALU_SHIFTER/A_[15..0] = sheet ALU_XOR/A_[15..0]
bus Bin_[15..0] = port Bin_[15..0] = sheet ALU_ADDER/B_[15..0] = sheet ALU_AND/B_[15..0] = sheet ALU_OR/B_[15..0] = sheet ALU_XOR/B_[15..0]
bus BUS_[15..0] = port BUS_[15..0] = sheet ALU_ADDER/OUT_[15..0] = sheet ALU_AND/OUT_[15..0] = sheet ALU_ONES/OUT_[15..0] = sheet ALU_OR/OUT_[15..0] = sheet ALU_SHIFTER/OUT_[15..0] = sheet ALU_XOR/OUT_[15..0] = sheet ALU_ZF/D_[15..0]
bus MODE_[3..0] = port MODE_[3..0]

### Notes on the sheet
- Modes:
  0 TRI-STATE
  1 ADD
  2 SUB
  3 AND
  4 OR
  5 XOR
  6 LEFT_SHIFT
  7 RIGHT_SHFT
  8 MULT
  9 ?
  10 ?
  11 ?
  12 ?
  13 ?
  14 ?
  15 ?
- Let's Build Rocket's Inc. Modular Paylaod System Based on TMP-010 Rev
  For more information visit https://github.com/LetsBuildRockets/Modular-Payload-System
  This work is licensed under CC BY-NC 4.0. To view a copy of this license, visit https://creativecommons.org/licenses/by-nc/4.0
- Title
- Size:
- Date:
- Assembly Variant:
- B
- Number:
- Time:
- Revision:
- Sheet
- of
- Author:
- File:

### Library data of the parts
U23 U24 = SN74LS138N: 3-Line to 8-Line Decoder / Demultiplexer; Published: 8-Jun-2000; LatestRevisionDate: 04-Mar-2005; LatestRevisionNote: Stylized 3D Model Added.; DatasheetVersion: Mar-1988; PackageVersion: Oct-1995; PackageReference: N016; Publisher: Altium Limited; PackageDescription: DIP; 16 Leads; Row Spacing 7.62 mm; Pitch 2.54 mm; Code_JEDEC: MS-001-BB; ComponentLink1Description: Manufacturer Link; ComponentLink1URL: http://www.ti.com/; ComponentLink2Description: Datasheet; ComponentLink2URL: http://www-s.ti.com/sc/ds/sn74ls138.pdf
U25#1 U25#2 = SN74LS04N: Hex Inverter; Published: 8-Jun-2000; LatestRevisionDate: 04-Mar-2005; LatestRevisionNote: Stylized 3D Model Added.; DatasheetVersion: Mar-1988; PackageVersion: Oct-1995; PackageReference: N014; Publisher: Altium Limited; PackageDescription: DIP; 14 Leads; Row Spacing 7.62 mm; Pitch 2.54 mm; ComponentLink1Description: Manufacturer Link; ComponentLink1URL: http://www.ti.com/; ComponentLink2Description: Datasheet; ComponentLink2URL: http://www-s.ti.com/sc/ds/sn74ls04.pdf
U26 = SN74LS32N: Quadruple 2-Input Positive-OR Gate; Published: 8-Jun-2000; LatestRevisionDate: 04-Mar-2005; LatestRevisionNote: Stylized 3D Model Added.; DatasheetVersion: Mar-1988; PackageVersion: Oct-1995; PackageReference: N014; Publisher: Altium Limited; PackageDescription: DIP; 14 Leads; Row Spacing 7.62 mm; Pitch 2.54 mm; ComponentLink1Description: Manufacturer Link; ComponentLink1URL: http://www.ti.com/; ComponentLink2Description: Datasheet; ComponentLink2URL: http://www-s.ti.com/sc/ds/sn74ls32.pdf
U78 = SN74LS173AN: as U19 on sheet Accumulator_Register; Published: 8-Jun-2000; LatestRevisionDate: 04-Mar-2005; LatestRevisionNote: Stylized 3D Model Added.; DatasheetVersion: Mar-1988; PackageVersion: Oct-1995; PackageReference: N016D; Publisher: Altium Limited; PackageDescription: DIP; 16 Leads; Row Spacing 7.62 mm; Pitch 2.54 mm; Code_JEDEC: MS-001-BB; ComponentLink1Description: Manufacturer Link; ComponentLink1URL: http://www.ti.com/; ComponentLink2Description: Datasheet; ComponentLink2URL: http://www-s.ti.com/sc/ds/sn74ls173a.pdf

## Sheet ALU_Adder.SchDoc
size B; Author: E. Sims; Organization: Let's Build Rockets Inc.; SheetNumber: 18; SheetTotal: 18
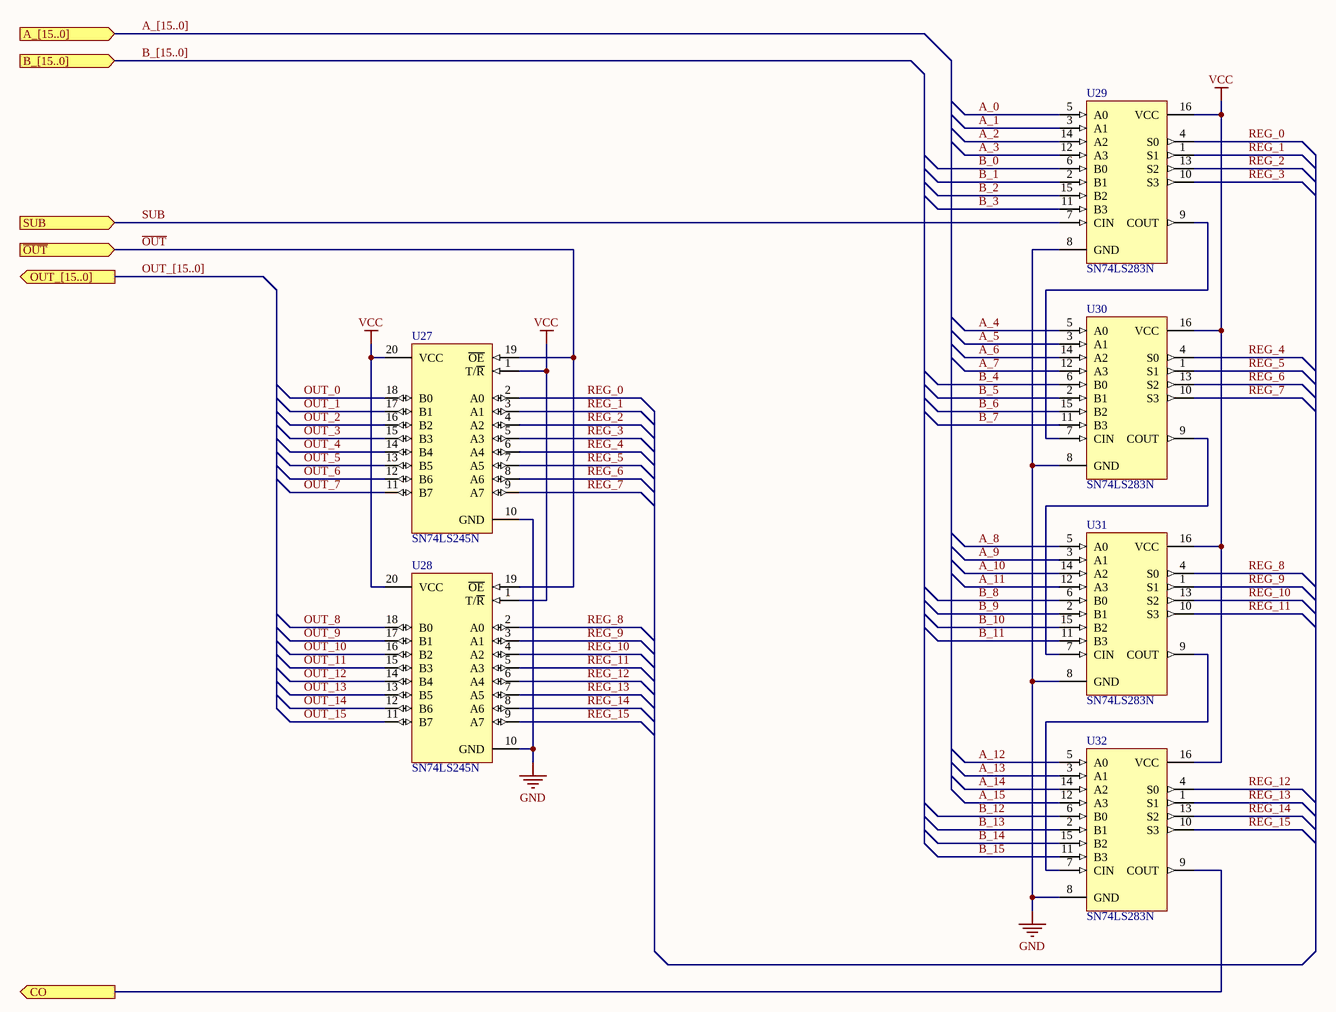
[diagram p7: ALU_Adder.SchDoc]

### Parts
U27  SN74LS245N  [N020]
U28  SN74LS245N  [N020]
U29  SN74LS283N  [W016]
U30  SN74LS283N  [W016]
U31  SN74LS283N  [W016]
U32  SN74LS283N  [W016]

### Ports
A_[15..0] (in), B_[15..0] (in), CO (out), OUT_[15..0] (out), SUB (in), ~{OUT} (in)

### Nets
GND: U27.10(GND) U28.10(GND) U29.8(GND) U30.8(GND) U31.8(GND) U32.8(GND)
VCC: U27.1(T/~{R}) U27.20(VCC) U28.1(T/~{R}) U28.20(VCC) U29.16(VCC) U30.16(VCC) U31.16(VCC) U32.16(VCC)
A_0: U29.5(A0)
A_1: U29.3(A1)
A_2: U29.14(A2)
A_3: U29.12(A3)
A_4: U30.5(A0)
A_5: U30.3(A1)
A_6: U30.14(A2)
A_7: U30.12(A3)
A_8: U31.5(A0)
A_9: U31.3(A1)
A_10: U31.14(A2)
A_11: U31.12(A3)
A_12: U32.5(A0)
A_13: U32.3(A1)
A_14: U32.14(A2)
A_15: U32.12(A3)
B_0: U29.6(B0)
B_1: U29.2(B1)
B_2: U29.15(B2)
B_3: U29.11(B3)
B_4: U30.6(B0)
B_5: U30.2(B1)
B_6: U30.15(B2)
B_7: U30.11(B3)
B_8: U31.6(B0)
B_9: U31.2(B1)
B_10: U31.15(B2)
B_11: U31.11(B3)
B_12: U32.6(B0)
B_13: U32.2(B1)
B_14: U32.15(B2)
B_15: U32.11(B3)
~{OUT}: U27.19(~{OE}) U28.19(~{OE}) ; port ~{OUT}  [project net ~{ADD_OUT}]
OUT_0: U27.18(B0)  [project net BUS_0]
OUT_1: U27.17(B1)  [project net BUS_1]
OUT_2: U27.16(B2)  [project net BUS_2]
OUT_3: U27.15(B3)  [project net BUS_3]
OUT_4: U27.14(B4)  [project net BUS_4]
OUT_5: U27.13(B5)  [project net BUS_5]
OUT_6: U27.12(B6)  [project net BUS_6]
OUT_7: U27.11(B7)  [project net BUS_7]
OUT_8: U28.18(B0)  [project net BUS_8]
OUT_9: U28.17(B1)  [project net BUS_9]
OUT_10: U28.16(B2)  [project net BUS_10]
OUT_11: U28.15(B3)  [project net BUS_11]
OUT_12: U28.14(B4)  [project net BUS_12]
OUT_13: U28.13(B5)  [project net BUS_13]
OUT_14: U28.12(B6)  [project net BUS_14]
OUT_15: U28.11(B7)  [project net BUS_15]
REG_0: U27.2(A0) U29.4(S0)
REG_1: U27.3(A1) U29.1(S1)
REG_2: U27.4(A2) U29.13(S2)
REG_3: U27.5(A3) U29.10(S3)
REG_4: U27.6(A4) U30.4(S0)
REG_5: U27.7(A5) U30.1(S1)
REG_6: U27.8(A6) U30.13(S2)
REG_7: U27.9(A7) U30.10(S3)
REG_8: U28.2(A0) U31.4(S0)
REG_9: U28.3(A1) U31.1(S1)
REG_10: U28.4(A2) U31.13(S2)
REG_11: U28.5(A3) U31.10(S3)
REG_12: U28.6(A4) U32.4(S0)
REG_13: U28.7(A5) U32.1(S1)
REG_14: U28.8(A6) U32.13(S2)
REG_15: U28.9(A7) U32.10(S3)
SUB: U29.7(CIN) ; port SUB
NetU29_9: U29.9(COUT) U30.7(CIN)
NetU30_9: U30.9(COUT) U31.7(CIN)
NetU31_9: U31.9(COUT) U32.7(CIN)
NetU32_9: U32.9(COUT) ; port CO

### Buses and harness runs
bus A_[15..0] = port A_[15..0]
bus B_[15..0] = port B_[15..0]
bus OUT_[15..0] = port OUT_[15..0]

### Notes on the sheet
- Let's Build Rocket's Inc. Modular Paylaod System Based on TMP-010 Rev
  For more information visit https://github.com/LetsBuildRockets/Modular-Payload-System
  This work is licensed under CC BY-NC 4.0. To view a copy of this license, visit https://creativecommons.org/licenses/by-nc/4.0
- Title
- Size:
- Date:
- Assembly Variant:
- B
- Number:
- Time:
- Revision:
- Sheet
- of
- Author:
- File:

### Library data of the parts
U27 U28 = SN74LS245N: as U17 on sheet Accumulator_Register; Published: 8-Jun-2000; LatestRevisionDate: 04-Mar-2005; LatestRevisionNote: Stylized 3D Model Added.; DatasheetVersion: Mar-1988; PackageVersion: Oct-1995; PackageReference: N020; Publisher: Altium Limited; PackageDescription: DIP; 20 Leads; Row Spacing 7.62 mm; Pitch 2.54 mm; ComponentLink1Description: Manufacturer Link; ComponentLink1URL: http://www.ti.com/; ComponentLink2Description: Datasheet; ComponentLink2URL: http://www-s.ti.com/sc/ds/sn74ls245.pdf
U29-U32 = SN74LS283N: 4-Bit Binary Full Adder with Fast Carry; Published: 8-Jun-2000; LatestRevisionDate: 04-Mar-2005; LatestRevisionNote: Stylized 3D Model Added.; DatasheetVersion: Mar-1988; PackageVersion: Jan-1995; PackageReference: W016; Publisher: Altium Limited; PackageDescription: DFP; 16 Leads; Body 10.9 x 7.2 mm (LxW max); Pitch 1.27 mm; ComponentLink1Description: Manufacturer Link; ComponentLink1URL: http://www.ti.com; ComponentLink2Description: Datasheet; ComponentLink2URL: http://www-s.ti.com/sc/ds/sn54ls283.pdf; Code_JEDEC: MO-092-AC

## Sheet ALU_AND.SchDoc
size B; Author: E. Sims; Organization: Let's Build Rockets Inc.; SheetNumber: 12; SheetTotal: 16
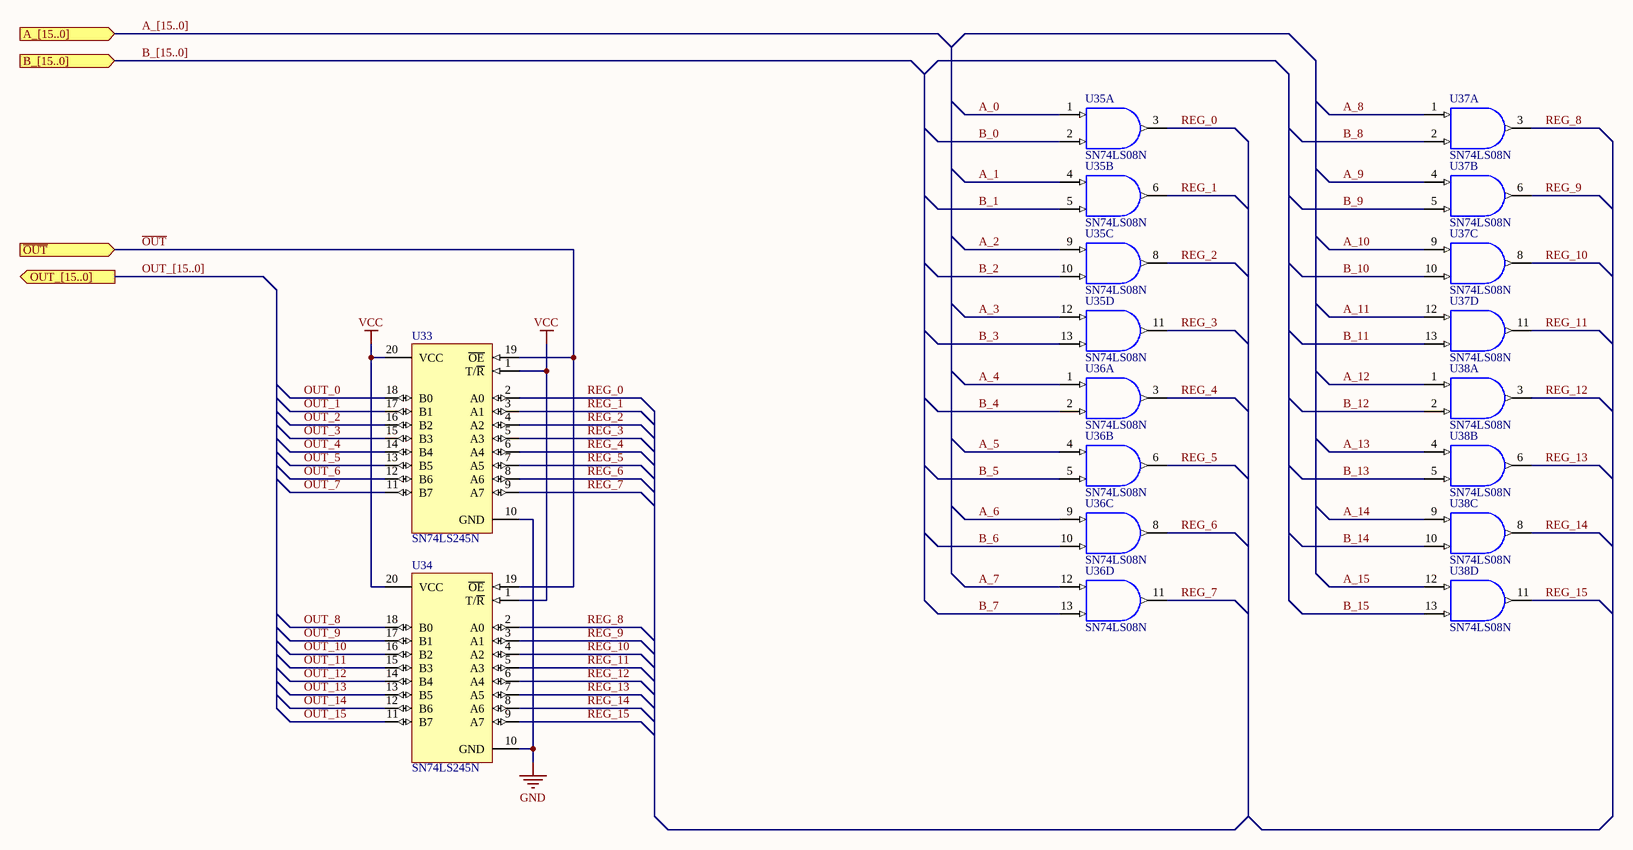
[diagram p8: ALU_AND.SchDoc]

### Parts
U33  SN74LS245N  [N020]
U34  SN74LS245N  [N020]
U35  SN74LS08N  [N014]  (parts A,B,C,D of 4)
U36  SN74LS08N  [N014]  (parts A,B,C,D of 4)
U37  SN74LS08N  [N014]  (parts A,B,C,D of 4)
U38  SN74LS08N  [N014]  (parts A,B,C,D of 4)

### Ports
A_[15..0] (in), B_[15..0] (in), OUT_[15..0] (out), ~{OUT} (in)

### Nets
GND: U33.10(GND) U34.10(GND) U35.7(GND) U36.7(GND) U37.7(GND) U38.7(GND)
VCC: U33.1(T/~{R}) U33.20(VCC) U34.1(T/~{R}) U34.20(VCC) U35.14(VCC) U36.14(VCC) U37.14(VCC) U38.14(VCC)
A_0: U35.1(A)
A_1: U35.4(A)
A_2: U35.9(A)
A_3: U35.12(A)
A_4: U36.1(A)
A_5: U36.4(A)
A_6: U36.9(A)
A_7: U36.12(A)
A_8: U37.1(A)
A_9: U37.4(A)
A_10: U37.9(A)
A_11: U37.12(A)
A_12: U38.1(A)
A_13: U38.4(A)
A_14: U38.9(A)
A_15: U38.12(A)
B_0: U35.2(B)
B_1: U35.5(B)
B_2: U35.10(B)
B_3: U35.13(B)
B_4: U36.2(B)
B_5: U36.5(B)
B_6: U36.10(B)
B_7: U36.13(B)
B_8: U37.2(B)
B_9: U37.5(B)
B_10: U37.10(B)
B_11: U37.13(B)
B_12: U38.2(B)
B_13: U38.5(B)
B_14: U38.10(B)
B_15: U38.13(B)
~{OUT}: U33.19(~{OE}) U34.19(~{OE}) ; port ~{OUT}  [project net ~{AND}]
OUT_0: U33.18(B0)  [project net BUS_0]
OUT_1: U33.17(B1)  [project net BUS_1]
OUT_2: U33.16(B2)  [project net BUS_2]
OUT_3: U33.15(B3)  [project net BUS_3]
OUT_4: U33.14(B4)  [project net BUS_4]
OUT_5: U33.13(B5)  [project net BUS_5]
OUT_6: U33.12(B6)  [project net BUS_6]
OUT_7: U33.11(B7)  [project net BUS_7]
OUT_8: U34.18(B0)  [project net BUS_8]
OUT_9: U34.17(B1)  [project net BUS_9]
OUT_10: U34.16(B2)  [project net BUS_10]
OUT_11: U34.15(B3)  [project net BUS_11]
OUT_12: U34.14(B4)  [project net BUS_12]
OUT_13: U34.13(B5)  [project net BUS_13]
OUT_14: U34.12(B6)  [project net BUS_14]
OUT_15: U34.11(B7)  [project net BUS_15]
REG_0: U33.2(A0) U35.3(Y)
REG_1: U33.3(A1) U35.6(Y)
REG_2: U33.4(A2) U35.8(Y)
REG_3: U33.5(A3) U35.11(Y)
REG_4: U33.6(A4) U36.3(Y)
REG_5: U33.7(A5) U36.6(Y)
REG_6: U33.8(A6) U36.8(Y)
REG_7: U33.9(A7) U36.11(Y)
REG_8: U34.2(A0) U37.3(Y)
REG_9: U34.3(A1) U37.6(Y)
REG_10: U34.4(A2) U37.8(Y)
REG_11: U34.5(A3) U37.11(Y)
REG_12: U34.6(A4) U38.3(Y)
REG_13: U34.7(A5) U38.6(Y)
REG_14: U34.8(A6) U38.8(Y)
REG_15: U34.9(A7) U38.11(Y)

### Buses and harness runs
bus A_[15..0] = port A_[15..0]
bus B_[15..0] = port B_[15..0]
bus OUT_[15..0] = port OUT_[15..0]

### Notes on the sheet
- Let's Build Rocket's Inc. Modular Paylaod System Based on TMP-010 Rev
  For more information visit https://github.com/LetsBuildRockets/Modular-Payload-System
  This work is licensed under CC BY-NC 4.0. To view a copy of this license, visit https://creativecommons.org/licenses/by-nc/4.0
- Title
- Size:
- Date:
- Assembly Variant:
- B
- Number:
- Time:
- Revision:
- Sheet
- of
- Author:
- File:

### Library data of the parts
U33 U34 = SN74LS245N: as U17 on sheet Accumulator_Register; Published: 8-Jun-2000; LatestRevisionDate: 04-Mar-2005; LatestRevisionNote: Stylized 3D Model Added.; DatasheetVersion: Mar-1988; PackageVersion: Oct-1995; PackageReference: N020; Publisher: Altium Limited; PackageDescription: DIP; 20 Leads; Row Spacing 7.62 mm; Pitch 2.54 mm; ComponentLink1Description: Manufacturer Link; ComponentLink1URL: http://www.ti.com/; ComponentLink2Description: Datasheet; ComponentLink2URL: http://www-s.ti.com/sc/ds/sn74ls245.pdf
U35-U38 = SN74LS08N: Quadruple 2-Input Positive-AND Gate; Published: 8-Jun-2000; LatestRevisionDate: 04-Mar-2005; LatestRevisionNote: Stylized 3D Model Added.; DatasheetVersion: Mar-1988; PackageVersion: Oct-1995; PackageReference: N014; Publisher: Altium Limited; PackageDescription: DIP; 14 Leads; Row Spacing 7.62 mm; Pitch 2.54 mm; ComponentLink1Description: Manufacturer Link; ComponentLink1URL: http://www.ti.com/; ComponentLink2Description: Datasheet; ComponentLink2URL: http://www-s.ti.com/sc/ds/SN74LS08.pdf

## Sheet ALU_OR.SchDoc
size B; Author: E. Sims; Organization: Let's Build Rockets Inc.; SheetNumber: 13; SheetTotal: 16
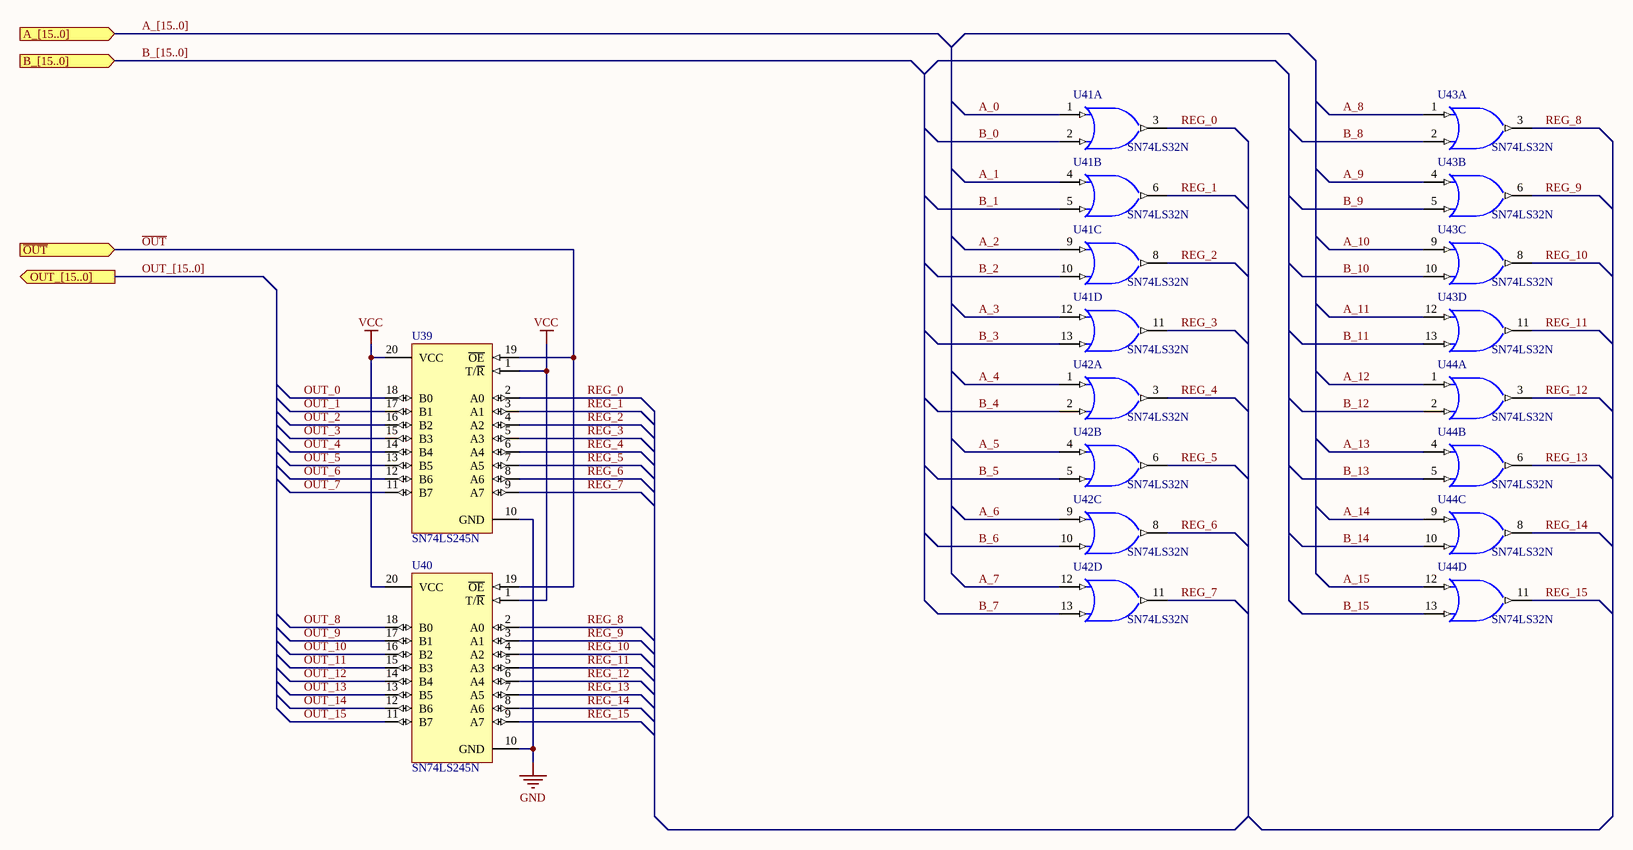
[diagram p9: ALU_OR.SchDoc]

### Parts
U39  SN74LS245N  [N020]
U40  SN74LS245N  [N020]
U41  SN74LS32N  [N014]  (parts A,B,C,D of 4)
U42  SN74LS32N  [N014]  (parts A,B,C,D of 4)
U43  SN74LS32N  [N014]  (parts A,B,C,D of 4)
U44  SN74LS32N  [N014]  (parts A,B,C,D of 4)

### Ports
A_[15..0] (in), B_[15..0] (in), OUT_[15..0] (out), ~{OUT} (in)

### Nets
GND: U39.10(GND) U40.10(GND) U41.7(GND) U42.7(GND) U43.7(GND) U44.7(GND)
VCC: U39.1(T/~{R}) U39.20(VCC) U40.1(T/~{R}) U40.20(VCC) U41.14(VCC) U42.14(VCC) U43.14(VCC) U44.14(VCC)
A_0: U41.1(A)
A_1: U41.4(A)
A_2: U41.9(A)
A_3: U41.12(A)
A_4: U42.1(A)
A_5: U42.4(A)
A_6: U42.9(A)
A_7: U42.12(A)
A_8: U43.1(A)
A_9: U43.4(A)
A_10: U43.9(A)
A_11: U43.12(A)
A_12: U44.1(A)
A_13: U44.4(A)
A_14: U44.9(A)
A_15: U44.12(A)
B_0: U41.2(B)
B_1: U41.5(B)
B_2: U41.10(B)
B_3: U41.13(B)
B_4: U42.2(B)
B_5: U42.5(B)
B_6: U42.10(B)
B_7: U42.13(B)
B_8: U43.2(B)
B_9: U43.5(B)
B_10: U43.10(B)
B_11: U43.13(B)
B_12: U44.2(B)
B_13: U44.5(B)
B_14: U44.10(B)
B_15: U44.13(B)
~{OUT}: U39.19(~{OE}) U40.19(~{OE}) ; port ~{OUT}  [project net ~{OR}]
OUT_0: U39.18(B0)  [project net BUS_0]
OUT_1: U39.17(B1)  [project net BUS_1]
OUT_2: U39.16(B2)  [project net BUS_2]
OUT_3: U39.15(B3)  [project net BUS_3]
OUT_4: U39.14(B4)  [project net BUS_4]
OUT_5: U39.13(B5)  [project net BUS_5]
OUT_6: U39.12(B6)  [project net BUS_6]
OUT_7: U39.11(B7)  [project net BUS_7]
OUT_8: U40.18(B0)  [project net BUS_8]
OUT_9: U40.17(B1)  [project net BUS_9]
OUT_10: U40.16(B2)  [project net BUS_10]
OUT_11: U40.15(B3)  [project net BUS_11]
OUT_12: U40.14(B4)  [project net BUS_12]
OUT_13: U40.13(B5)  [project net BUS_13]
OUT_14: U40.12(B6)  [project net BUS_14]
OUT_15: U40.11(B7)  [project net BUS_15]
REG_0: U39.2(A0) U41.3(Y)
REG_1: U39.3(A1) U41.6(Y)
REG_2: U39.4(A2) U41.8(Y)
REG_3: U39.5(A3) U41.11(Y)
REG_4: U39.6(A4) U42.3(Y)
REG_5: U39.7(A5) U42.6(Y)
REG_6: U39.8(A6) U42.8(Y)
REG_7: U39.9(A7) U42.11(Y)
REG_8: U40.2(A0) U43.3(Y)
REG_9: U40.3(A1) U43.6(Y)
REG_10: U40.4(A2) U43.8(Y)
REG_11: U40.5(A3) U43.11(Y)
REG_12: U40.6(A4) U44.3(Y)
REG_13: U40.7(A5) U44.6(Y)
REG_14: U40.8(A6) U44.8(Y)
REG_15: U40.9(A7) U44.11(Y)

### Buses and harness runs
bus A_[15..0] = port A_[15..0]
bus B_[15..0] = port B_[15..0]
bus OUT_[15..0] = port OUT_[15..0]

### Notes on the sheet
- Let's Build Rocket's Inc. Modular Paylaod System Based on TMP-010 Rev
  For more information visit https://github.com/LetsBuildRockets/Modular-Payload-System
  This work is licensed under CC BY-NC 4.0. To view a copy of this license, visit https://creativecommons.org/licenses/by-nc/4.0
- Title
- Size:
- Date:
- Assembly Variant:
- B
- Number:
- Time:
- Revision:
- Sheet
- of
- Author:
- File:

### Library data of the parts
U39 U40 = SN74LS245N: as U17 on sheet Accumulator_Register; Published: 8-Jun-2000; LatestRevisionDate: 04-Mar-2005; LatestRevisionNote: Stylized 3D Model Added.; DatasheetVersion: Mar-1988; PackageVersion: Oct-1995; PackageReference: N020; Publisher: Altium Limited; PackageDescription: DIP; 20 Leads; Row Spacing 7.62 mm; Pitch 2.54 mm; ComponentLink1Description: Manufacturer Link; ComponentLink1URL: http://www.ti.com/; ComponentLink2Description: Datasheet; ComponentLink2URL: http://www-s.ti.com/sc/ds/sn74ls245.pdf
U41-U44 = SN74LS32N: Quadruple 2-Input Positive-OR Gate; Published: 8-Jun-2000; LatestRevisionDate: 04-Mar-2005; LatestRevisionNote: Stylized 3D Model Added.; DatasheetVersion: Mar-1988; PackageVersion: Oct-1995; PackageReference: N014; Publisher: Altium Limited; PackageDescription: DIP; 14 Leads; Row Spacing 7.62 mm; Pitch 2.54 mm; ComponentLink1Description: Manufacturer Link; ComponentLink1URL: http://www.ti.com/; ComponentLink2Description: Datasheet; ComponentLink2URL: http://www-s.ti.com/sc/ds/sn74ls32.pdf

## Sheet ALU_XOR.SchDoc
size B; Author: E. Sims; Organization: Let's Build Rockets Inc.; SheetNumber: 14; SheetTotal: 16
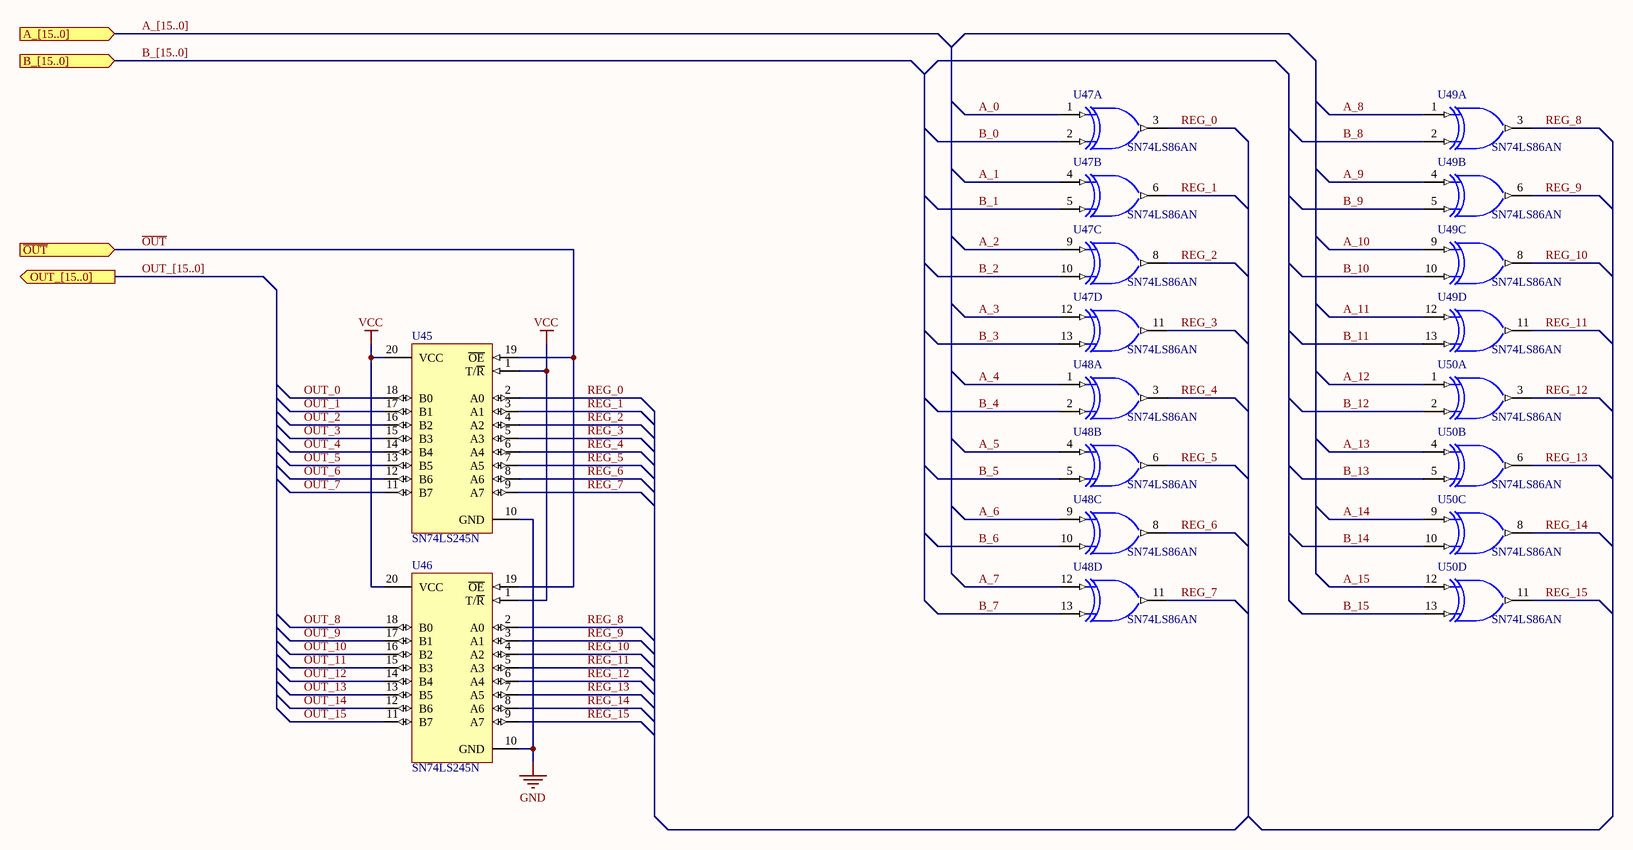
[diagram p10: ALU_XOR.SchDoc]

### Parts
U45  SN74LS245N  [N020]
U46  SN74LS245N  [N020]
U47  SN74LS86AN  [N014]  (parts A,B,C,D of 4)
U48  SN74LS86AN  [N014]  (parts A,B,C,D of 4)
U49  SN74LS86AN  [N014]  (parts A,B,C,D of 4)
U50  SN74LS86AN  [N014]  (parts A,B,C,D of 4)

### Ports
A_[15..0] (in), B_[15..0] (in), OUT_[15..0] (out), ~{OUT} (in)

### Nets
GND: U45.10(GND) U46.10(GND) U47.7(GND) U48.7(GND) U49.7(GND) U50.7(GND)
VCC: U45.1(T/~{R}) U45.20(VCC) U46.1(T/~{R}) U46.20(VCC) U47.14(VCC) U48.14(VCC) U49.14(VCC) U50.14(VCC)
A_0: U47.1(A)
A_1: U47.4(A)
A_2: U47.9(A)
A_3: U47.12(A)
A_4: U48.1(A)
A_5: U48.4(A)
A_6: U48.9(A)
A_7: U48.12(A)
A_8: U49.1(A)
A_9: U49.4(A)
A_10: U49.9(A)
A_11: U49.12(A)
A_12: U50.1(A)
A_13: U50.4(A)
A_14: U50.9(A)
A_15: U50.12(A)
B_0: U47.2(B)
B_1: U47.5(B)
B_2: U47.10(B)
B_3: U47.13(B)
B_4: U48.2(B)
B_5: U48.5(B)
B_6: U48.10(B)
B_7: U48.13(B)
B_8: U49.2(B)
B_9: U49.5(B)
B_10: U49.10(B)
B_11: U49.13(B)
B_12: U50.2(B)
B_13: U50.5(B)
B_14: U50.10(B)
B_15: U50.13(B)
~{OUT}: U45.19(~{OE}) U46.19(~{OE}) ; port ~{OUT}
OUT_0: U45.18(B0)  [project net BUS_0]
OUT_1: U45.17(B1)  [project net BUS_1]
OUT_2: U45.16(B2)  [project net BUS_2]
OUT_3: U45.15(B3)  [project net BUS_3]
OUT_4: U45.14(B4)  [project net BUS_4]
OUT_5: U45.13(B5)  [project net BUS_5]
OUT_6: U45.12(B6)  [project net BUS_6]
OUT_7: U45.11(B7)  [project net BUS_7]
OUT_8: U46.18(B0)  [project net BUS_8]
OUT_9: U46.17(B1)  [project net BUS_9]
OUT_10: U46.16(B2)  [project net BUS_10]
OUT_11: U46.15(B3)  [project net BUS_11]
OUT_12: U46.14(B4)  [project net BUS_12]
OUT_13: U46.13(B5)  [project net BUS_13]
OUT_14: U46.12(B6)  [project net BUS_14]
OUT_15: U46.11(B7)  [project net BUS_15]
REG_0: U45.2(A0) U47.3(Y)
REG_1: U45.3(A1) U47.6(Y)
REG_2: U45.4(A2) U47.8(Y)
REG_3: U45.5(A3) U47.11(Y)
REG_4: U45.6(A4) U48.3(Y)
REG_5: U45.7(A5) U48.6(Y)
REG_6: U45.8(A6) U48.8(Y)
REG_7: U45.9(A7) U48.11(Y)
REG_8: U46.2(A0) U49.3(Y)
REG_9: U46.3(A1) U49.6(Y)
REG_10: U46.4(A2) U49.8(Y)
REG_11: U46.5(A3) U49.11(Y)
REG_12: U46.6(A4) U50.3(Y)
REG_13: U46.7(A5) U50.6(Y)
REG_14: U46.8(A6) U50.8(Y)
REG_15: U46.9(A7) U50.11(Y)

### Buses and harness runs
bus A_[15..0] = port A_[15..0]
bus B_[15..0] = port B_[15..0]
bus OUT_[15..0] = port OUT_[15..0]

### Notes on the sheet
- Let's Build Rocket's Inc. Modular Paylaod System Based on TMP-010 Rev
  For more information visit https://github.com/LetsBuildRockets/Modular-Payload-System
  This work is licensed under CC BY-NC 4.0. To view a copy of this license, visit https://creativecommons.org/licenses/by-nc/4.0
- Title
- Size:
- Date:
- Assembly Variant:
- B
- Number:
- Time:
- Revision:
- Sheet
- of
- Author:
- File:

### Library data of the parts
U45 U46 = SN74LS245N: as U17 on sheet Accumulator_Register; Published: 8-Jun-2000; LatestRevisionDate: 04-Mar-2005; LatestRevisionNote: Stylized 3D Model Added.; DatasheetVersion: Mar-1988; PackageVersion: Oct-1995; PackageReference: N020; Publisher: Altium Limited; PackageDescription: DIP; 20 Leads; Row Spacing 7.62 mm; Pitch 2.54 mm; ComponentLink1Description: Manufacturer Link; ComponentLink1URL: http://www.ti.com/; ComponentLink2Description: Datasheet; ComponentLink2URL: http://www-s.ti.com/sc/ds/sn74ls245.pdf
U47-U50 = SN74LS86AN: Quadruple 2-Input Exclusive-OR Gate; Published: 8-Jun-2000; LatestRevisionDate: 04-Mar-2005; LatestRevisionNote: Stylized 3D Model Added.; DatasheetVersion: Mar-1988; PackageVersion: Oct-1995; PackageReference: N014; Publisher: Altium Limited; PackageDescription: DIP; 14 Leads; Row Spacing 7.62 mm; Pitch 2.54 mm; ComponentLink1Description: Manufacturer Link; ComponentLink1URL: http://www.ti.com/; ComponentLink2Description: Datasheet; ComponentLink2URL: http://www-s.ti.com/sc/ds/sn74ls86a.pdf